# Altium project UC-523.PrjPCB (part 1 of 3)
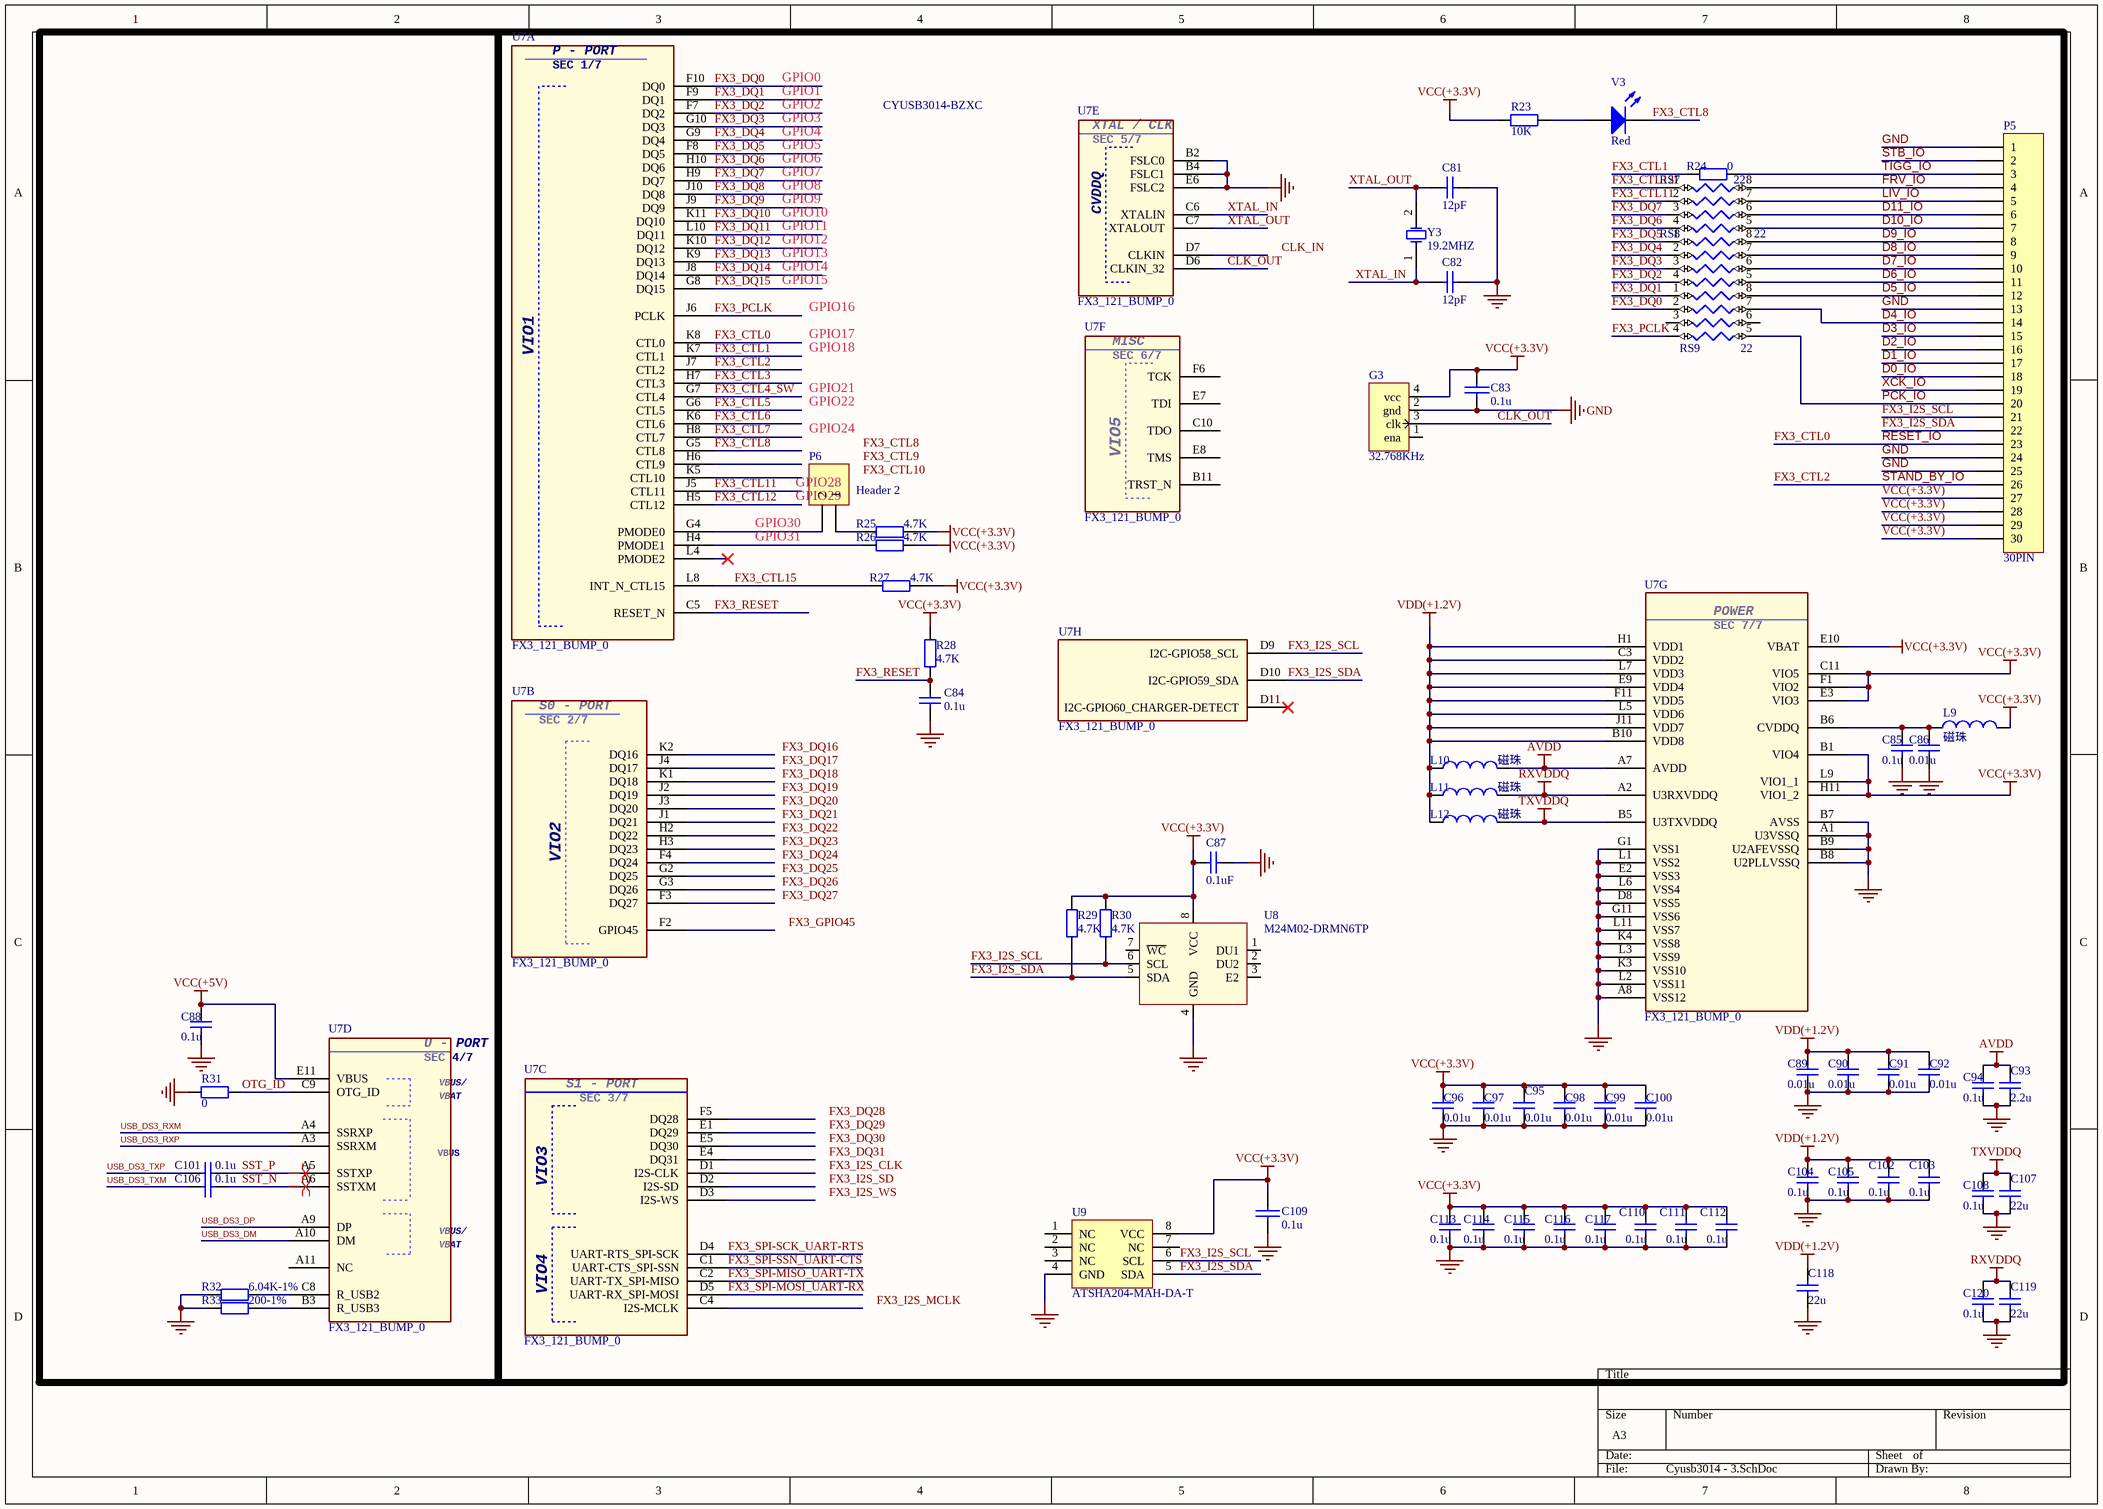
[diagram p0: Cyusb3014 - 3.SchDoc]
12 sheets, 764 parts. Net scope: flat (ports and power ports of the same name join across sheets).
Board file: UC-523.PcbDoc
Sheets:
  Cyusb3014 - 3.SchDoc
  Cyusb3014 - 4.SchDoc
  Cyusb3014 - 2.SchDoc
  LED_Driver - 2.SchDoc
  LED_Driver - 3.SchDoc
  LED_Driver - 4.SchDoc
  Cyusb3314_Power.SchDoc
  Cyusb3314_Interface.SchDoc
  Cyusb3314_Indicator.SchDoc
  Power.SchDoc
    U_Cyusb3014 - 1 = Cyusb3014 - 1.SchDoc
    U_LED_Driver - 1 = LED_Driver - 1.SchDoc

## Sheet Cyusb3014 - 3.SchDoc
size A3

### Parts
C81  12pF  [0603S-CAP]
C82  12pF  [0603S-CAP]
C83  0.1u  [0603S-CAP]
C84  0.1u  [0603S-CAP]
C85  0.1u  [C0402]
C86  0.01u  [C0402]
C87  0.1uF  [0603S-CAP]
C88  0.1u  [C0402]
C89  0.01u  [C0402]
C90  0.01u  [C0402]
C91  0.01u  [C0402]
C92  0.01u  [C0402]
C93  2.2u  [C0805S-CAP]
C94  0.1u  [C0402]
C95  0.01u  [C0402]
C96  0.01u  [C0402]
C97  0.01u  [C0402]
C98  0.01u  [C0402]
C99  0.01u  [C0402]
C100  0.01u  [C0402]
C101  0.1u  [C0402]
C102  0.1u  [C0402]
C103  0.1u  [C0402]
C104  0.1u  [C0402]
C105  0.1u  [C0402]
C106  0.1u  [C0402]
C107  22u  [C0805S-CAP]
C108  0.1u  [C0402]
C109  0.1u  [0603S-CAP]
C110  0.1u  [C0402]
C111  0.1u  [C0402]
C112  0.1u  [C0402]
C113  0.1u  [C0402]
C114  0.1u  [C0402]
C115  0.1u  [C0402]
C116  0.1u  [C0402]
C117  0.1u  [C0402]
C118  22u  [C0805S-CAP]
C119  22u  [C0805S-CAP]
C120  0.1u  [C0402]
G3  32.768KHz  [爱普生晶振3.2×2.5mm]
L9  磁珠  [L0603]
L10  磁珠  [L0603]
L11  磁珠  [L0603]
L12  磁珠  [L0603]
P5  30PIN  [FH12-30S-0.5SH]
P6  Header 2  [HDR1X2]
R23  10K  [0603S-RES]
R24  0  [0603S-RES]
R25  4.7K  [0603S-RES]
R26  4.7K  [0603S-RES]
R27  4.7K  [0603S-RES]
R28  4.7K  [0603S-RES]
R29  4.7K  [0603S-RES]
R30  4.7K  [0603S-RES]
R31  0  [0603S-RES]
R32  6.04K-1%  [0603S-RES]
R33  200-1%  [0603S-RES]
RS7  22  [NC06-4]
RS8  22  [NC06-4]
RS9  22  [NC06-4]
U7  FX3_121_BUMP_0  [121_BGA_FX3]  (parts A,B,C,D,E,F,G,H of 8)
U8  M24M02-DRMN6TP  [SOIC127P600X175-8N]
U9  ATSHA204-MAH-DA-T  [UDFN]
V3  Red  [LED0805S]
Y3  19.2MHZ  [爱普生晶振3.2×2.5MM - 无源]

### Nets
AVDD: C93.2 C94.1 L10.2 U7.A7(AVDD)
GND: C81.1 C82.1 C83.2 C84.1 C85.2 C86.2 C87.1 C88.2 C89.2 C90.2 C91.2 C92.2 C93.1 C94.2 C95.2 C96.2 C97.2 C98.2 C99.2 C100.2 C102.2 C103.2 C104.2 C105.2 C107.1 C108.2 C109.2 C110.2 C111.2 C112.2 C113.2 C114.2 C115.2 C116.2 C117.2 C118.1 C119.1 C120.2 G3.2(gnd) P5.1 P5.13 P5.24 P5.25 R31.2 R32.2 R33.2 U7.A1(U3VSSQ) U7.A8(VSS12) U7.B2(FSLC0) U7.B4(FSLC1) U7.B7(AVSS) U7.B8(U2PLLVSSQ) U7.B9(U2AFEVSSQ) U7.D8(VSS5) U7.E2(VSS3) U7.E6(FSLC2) U7.G1(VSS1) U7.G11(VSS6) U7.K3(VSS10) U7.K4(VSS8) U7.L1(VSS2) U7.L2(VSS11) U7.L3(VSS9) U7.L6(VSS4) U7.L11(VSS7) U8.4(GND) U9.4(GND)
RXVDDQ: C119.2 C120.1 L11.2 U7.A2(U3RXVDDQ)
TXVDDQ: C107.2 C108.1 L12.2 U7.B5(U3TXVDDQ)
VCC(+3.3V): C83.1 C87.2 C95.1 C96.1 C97.1 C98.1 C99.1 C100.1 C109.1 C110.1 C111.1 C112.1 C113.1 C114.1 C115.1 C116.1 C117.1 G3.4(vcc) L9.2 P5.27 P5.28 P5.29 P5.30 R23.2 R25.2 R26.2 R27.1 R28.1 R29.2 R30.2 U7.B1(VIO4) U7.C11(VIO5) U7.E3(VIO3) U7.E10(VBAT) U7.F1(VIO2) U7.H11(VIO1_2) U7.L9(VIO1_1) U8.8(VCC) U9.8(VCC)
VCC(+5V): C88.1 U7.E11(VBUS)
VDD(+1.2V): C89.1 C90.1 C91.1 C92.1 C102.1 C103.1 C104.1 C105.1 C118.2 L10.1 L11.1 L12.1 U7.B10(VDD8) U7.C3(VDD2) U7.E9(VDD4) U7.F11(VDD5) U7.H1(VDD1) U7.J11(VDD7) U7.L5(VDD6) U7.L7(VDD3)  [project net V1p2]
CLK_OUT: G3.3(clk) U7.D6(CLKIN_32)
D0_IO: P5.18
D1_IO: P5.17
D2_IO: P5.16
D3_IO: P5.15
D4_IO: P5.14 RS9.7
D5_IO: P5.12 RS9.8
D6_IO: P5.11 RS8.5
D7_IO: P5.10 RS8.6
D8_IO: P5.9 RS8.7
D9_IO: P5.8 RS8.8
D10_IO: P5.7 RS7.5
D11_IO: P5.6 RS7.6
FRV_IO: P5.4 RS7.8
FX3_CTL0: P5.23 U7.K8(CTL0)  [also labelled RESET_IO]
FX3_CTL1: R24.2 U7.K7(CTL1)
FX3_CTL2: P5.26 U7.J7(CTL2)  [also labelled STAND_BY_IO]
FX3_CTL3: U7.H7(CTL3)
FX3_CTL4_SW: U7.G7(CTL4)
FX3_CTL5: U7.G6(CTL5)
FX3_CTL6: U7.K6(CTL6)
FX3_CTL7: U7.H8(CTL7)
FX3_CTL8: U7.G5(CTL8) V3.2(K)
FX3_CTL11: RS7.2 U7.J5(CTL11)
FX3_CTL12: RS7.1 U7.H5(CTL12)
FX3_CTL15: R27.2 U7.L8(INT_N_CTL15)
FX3_DQ0: RS9.2 U7.F10(DQ0)
FX3_DQ1: RS9.1 U7.F9(DQ1)
FX3_DQ2: RS8.4 U7.F7(DQ2)
FX3_DQ3: RS8.3 U7.G10(DQ3)
FX3_DQ4: RS8.2 U7.G9(DQ4)
FX3_DQ5: RS8.1 U7.F8(DQ5)
FX3_DQ6: RS7.4 U7.H10(DQ6)
FX3_DQ7: RS7.3 U7.H9(DQ7)
FX3_DQ8: U7.J10(DQ8)
FX3_DQ9: U7.J9(DQ9)
FX3_DQ10: U7.K11(DQ10)
FX3_DQ11: U7.L10(DQ11)
FX3_DQ12: U7.K10(DQ12)
FX3_DQ13: U7.K9(DQ13)
FX3_DQ14: U7.J8(DQ14)
FX3_DQ15: U7.G8(DQ15)
FX3_I2S_SCL: P5.21 R30.1 U7.D9(I2C-GPIO58_SCL) U8.6(SCL) U9.6(SCL)
FX3_I2S_SDA: P5.22 R29.1 U7.D10(I2C-GPIO59_SDA) U8.5(SDA) U9.5(SDA)
FX3_PCLK: RS9.4 U7.J6(PCLK)
FX3_RESET: C84.2 R28.2 U7.C5(RESET_N)
FX3_SPI-MISO_UART-TX: U7.C2(UART-TX_SPI-MISO)
FX3_SPI-MOSI_UART-RX: U7.D5(UART-RX_SPI-MOSI)
FX3_SPI-SCK_UART-RTS: U7.D4(UART-RTS_SPI-SCK)
FX3_SPI-SSN_UART-CTS: U7.C1(UART-CTS_SPI-SSN)
LIV_IO: P5.5 RS7.7
OTG_ID: R31.1 U7.C9(OTG_ID)
PCK_IO: P5.20 RS9.5
SST_N: C106.2 U7.A6(SSTXM)
SST_P: C101.2 U7.A5(SSTXP)
STB_IO: P5.2
TIGG_IO: P5.3 R24.1
USB_DS3_DM: U7.A10(DM)
USB_DS3_DP: U7.A9(DP)
USB_DS3_RXM: U7.A4(SSRXP)
USB_DS3_RXP: U7.A3(SSRXM)
USB_DS3_TXM: C106.1
USB_DS3_TXP: C101.1
XCK_IO: P5.19
XTAL_IN: C82.2 U7.C6(XTALIN) Y3.1(OSC1)
XTAL_OUT: C81.2 U7.C7(XTALOUT) Y3.2(OSC2)
NetC85_1: C85.1 C86.1 L9.1 U7.B6(CVDDQ)
NetP6_1: P6.1 R25.1
NetP6_2: P6.2 U7.G4(PMODE0)
NetR23_1: R23.1 V3.1(A)
NetR26_1: R26.1 U7.H4(PMODE1)
NetR32_1: R32.1 U7.C8(R_USB2)
NetR33_1: R33.1 U7.B3(R_USB3)

Not connected (* = marked no-connect by the designer): G3 1(ena); RS9 3 6; U7 A11(NC) B11(TRST_N) C4(I2S-MCLK) C10(TDO) D1(I2S-CLK) D2(I2S-SD) D3(I2S-WS) D7(CLKIN) D11(I2C-GPIO60_CHARGER-DETECT)* E1(DQ29) E4(DQ31) E5(DQ30) E7(TDI) E8(TMS) F2(GPIO45) F3(DQ27) F4(DQ24) F5(DQ28) F6(TCK) G2(DQ25) G3(DQ26) H2(DQ22) H3(DQ23) H6(CTL9) J1(DQ21) J2(DQ19) J3(DQ20) J4(DQ17) K1(DQ18) K2(DQ16) K5(CTL10) L4(PMODE2)*; U8 1(DU1) 2(DU2) 3(E2) 7(~{WC}); U9 1(NC) 2(NC) 3(NC) 7(NC)

### Layout directives
differential pair: SST_N, SST_P

### Notes on the sheet
- GPIO0
- GPIO1
- GPIO2
- CYUSB3014-BZXC
- GPIO3
- GPIO4
- GPIO5
- GPIO6
- GPIO7
- GPIO8
- GPIO9
- GPIO10
- GPIO11
- GPIO12
- GPIO13
- GPIO14
- GPIO15
- GPIO16
- GPIO17
- GPIO18
- GPIO21
- GPIO22
- GPIO24
- (near P6) GPIO28
- (near P6) GPIO29
- (near P6) GPIO30
- (near P6) GPIO31
- Labels drawn without touching a wire or pin: CLK_IN, FX3_CTL8, FX3_CTL9, FX3_CTL10, FX3_DQ16, FX3_DQ17, FX3_DQ18, FX3_DQ19, FX3_DQ20, FX3_DQ21, FX3_DQ22, FX3_DQ23, FX3_DQ24, FX3_DQ25, FX3_DQ26, FX3_DQ27, FX3_DQ28, FX3_DQ29, FX3_DQ30, FX3_DQ31, FX3_GPIO45, FX3_I2S_CLK, FX3_I2S_MCLK, FX3_I2S_SD, FX3_I2S_WS
- (in symbol FX3_121_BUMP_0, part A) P - PORT; SEC 1/7; VIO1
- (in symbol FX3_121_BUMP_0, part B) S0 - PORT; SEC 2/7
- (in symbol FX3_121_BUMP_0, part C) S1 - PORT; SEC 3/7
- (in symbol FX3_121_BUMP_0, part D) U - PORT; SEC 4/7; VBUS/
- (in symbol FX3_121_BUMP_0, part E) XTAL / CLK; SEC 5/7
- (in symbol FX3_121_BUMP_0, part F) MISC; SEC 6/7
- (in symbol FX3_121_BUMP_0, part G) POWER; SEC 7/7

### Library data of the parts
C81 C82 = CAP CER SMT 4.3pF 0805: 2. Manufacturere Part Number: C0805C439D5GACTU; 1. Manufacturer: Kemet; 8. Alternate Part: any; 7. Package / Case: 0805; 0. Do Not Install: DNI; 6. Mounting Type: SMT; 5. Supplier Link: http://www.digikey.com/product-detail/en/C0805C439D5GACTU/C0805C439D5GACTU-ND/2212763; 3. Supplier: Digi-Key; 4. Supplier Part Number: C0805C439D5GACTU-ND
C83 C109 = CAP: RC=1206
C84 = Cap: 50V/8.2u/0805; Value: 100n; Published: 8-Jun-2000; LatestRevisionDate: 17-Jul-2002; LatestRevisionNote: Re-released for DXP Platform.; PackageReference: RAD-0.3; Publisher: Altium Limited
C85 C86 C88-C108 C110-C120 = CAP0805: Capacitor; Value: 104; Published: 8-Jun-2000; Revision: July-2002: Re-released for DXP Platform.; Publisher: Altium Limited
C87 = CAP SMT 0.1uF 16V X7R: 2. Manufacturere Part Number: C0805C104K4RACTU; 1. Manufacturer: Kemet; 8. Alternate Part: any; 7. Package / Case: 0805; 6. Mounting Type: SMT; 5. Supplier Link: http://www.digikey.com/product-detail/en/C0805C104K4RACTU/399-1167-1-ND/411442; 3. Supplier: Digi-Key; 4. Supplier Part Number: 399-1167-1-ND
G3 = CTY4-B
L9-L12 = Inductor: Code_IEC: 1005; Value: 10mH; Published: 8-Jun-2000; LatestRevisionDate: 29-May-2009; LatestRevisionNote: IPC-7351 Footprint Added.; PackageReference: 0402-A; Publisher: Altium Limited; PackageDescription: Chip Inductor; Code_JEITA: 0402
P5 = Header 30: Header, 30-Pin; LatestRevisionDate: 17-Jul-2002; LatestRevisionNote: Re-released for DXP Platform.; Publisher: Altium Limited
P6 = Header 2: Header, 2-Pin; LatestRevisionDate: 17-Jul-2002; LatestRevisionNote: Re-released for DXP Platform.; Publisher: Altium Limited
R23 = Res2: Resistor; Published: 8-Jun-2000; LatestRevisionDate: 17-Jul-2002; LatestRevisionNote: Re-released for DXP Platform.; PackageReference: AXIAL-0.4; Publisher: Altium Limited; Value: 10K
R24-R33 = Res2: Resistor; Value: 10K; Published: 8-Jun-2000; LatestRevisionDate: 17-Jul-2002; LatestRevisionNote: Re-released for DXP Platform.; PackageReference: AXIAL-0.4; Publisher: Altium Limited
RS7-RS9 = RN4: Option 2 - Device: *; Option 2 - Spec: *; Option 3 - Device: *; Option 3 - Spec: *; Option 4 - Device: *; Option 4 - Spec: *; Option 5 - Device: *; Option 5 - Spec: *; Option 6 - Device: *; Option 6 - Spec: *; Option 7 - Device: *; Option 7 - Spec: *; Option 8 - Device: *; Option 8 - Spec: *
U8 = 24LC64-I/SN: IC EEPROM 64KBIT 400KHZ 8SOIC; Manufacturer: Microchip Technology; Format - Memory: EEPROMs - Serial; Memory Size: 64K (8K x 8); Interface: I2C, 2-Wire Serial; Voltage - Supply: 2.5 V ~ 5.5 V; Supplier 1: Digi-Key; Manufacturer Part Number: 24LC64-I/SN; RoHS: RoHS Compliant; Category: Integrated Circuits (ICs); Stock 1: 16323; Pricing 1: 1=0.38, 25=0.37, 100=0.35 (USD); Packaging: Tube; Memory Type: EEPROM; Speed: 400kHz; Operating Temperature: -40°C ~ 85°C (TA); Package / Case: 8-SOIC (0.154", 3.90mm Width); Supplier Device Package: 8-SOIC; ComponentLink1URL: http://www.microchip.com/mymicrochip/filehandler.aspx?ddocname=en011843; ComponentLink1Description: http://www.microchip.com/mymicrochip/filehandler.aspx?ddocname=en011843; Supplier Part Number 1: 24LC64-I/SN-ND
U9 = AT24C128
V3 = LED0: Typical INFRARED GaAs LED; Published: 8-Jun-2000; LatestRevisionDate: 08-Jul-2005; LatestRevisionNote: Mech Layer 1 removed.; PackageReference: LED-0; Publisher: Altium Limited
Y3 = XTAL 32.768KHZ: Crystal, CRYSTAL 32.768KHZ 6PF SMD; 2. Manufacturere Part Number: ABS07-120-32.768KHZ-T; 1. Manufacturer: Abracon; 6. Mounting Type: SMT; 9. Notes: 2 pad - Abracon ABS07-120-32.768KHZ-T, 4 pad - Abracon ABS25-32.768KHZ-6-T; 0. Do Not Install: DNI; 5. Supplier Link: http://www.digikey.com/product-detail/en/ABS07-120-32.768KHZ-T/535-11937-1-ND/3724046; 3. Supplier: Digi-Key; 4. Supplier Part Number: 535-11937-1-ND

## Sheet Cyusb3014 - 4.SchDoc
size A3
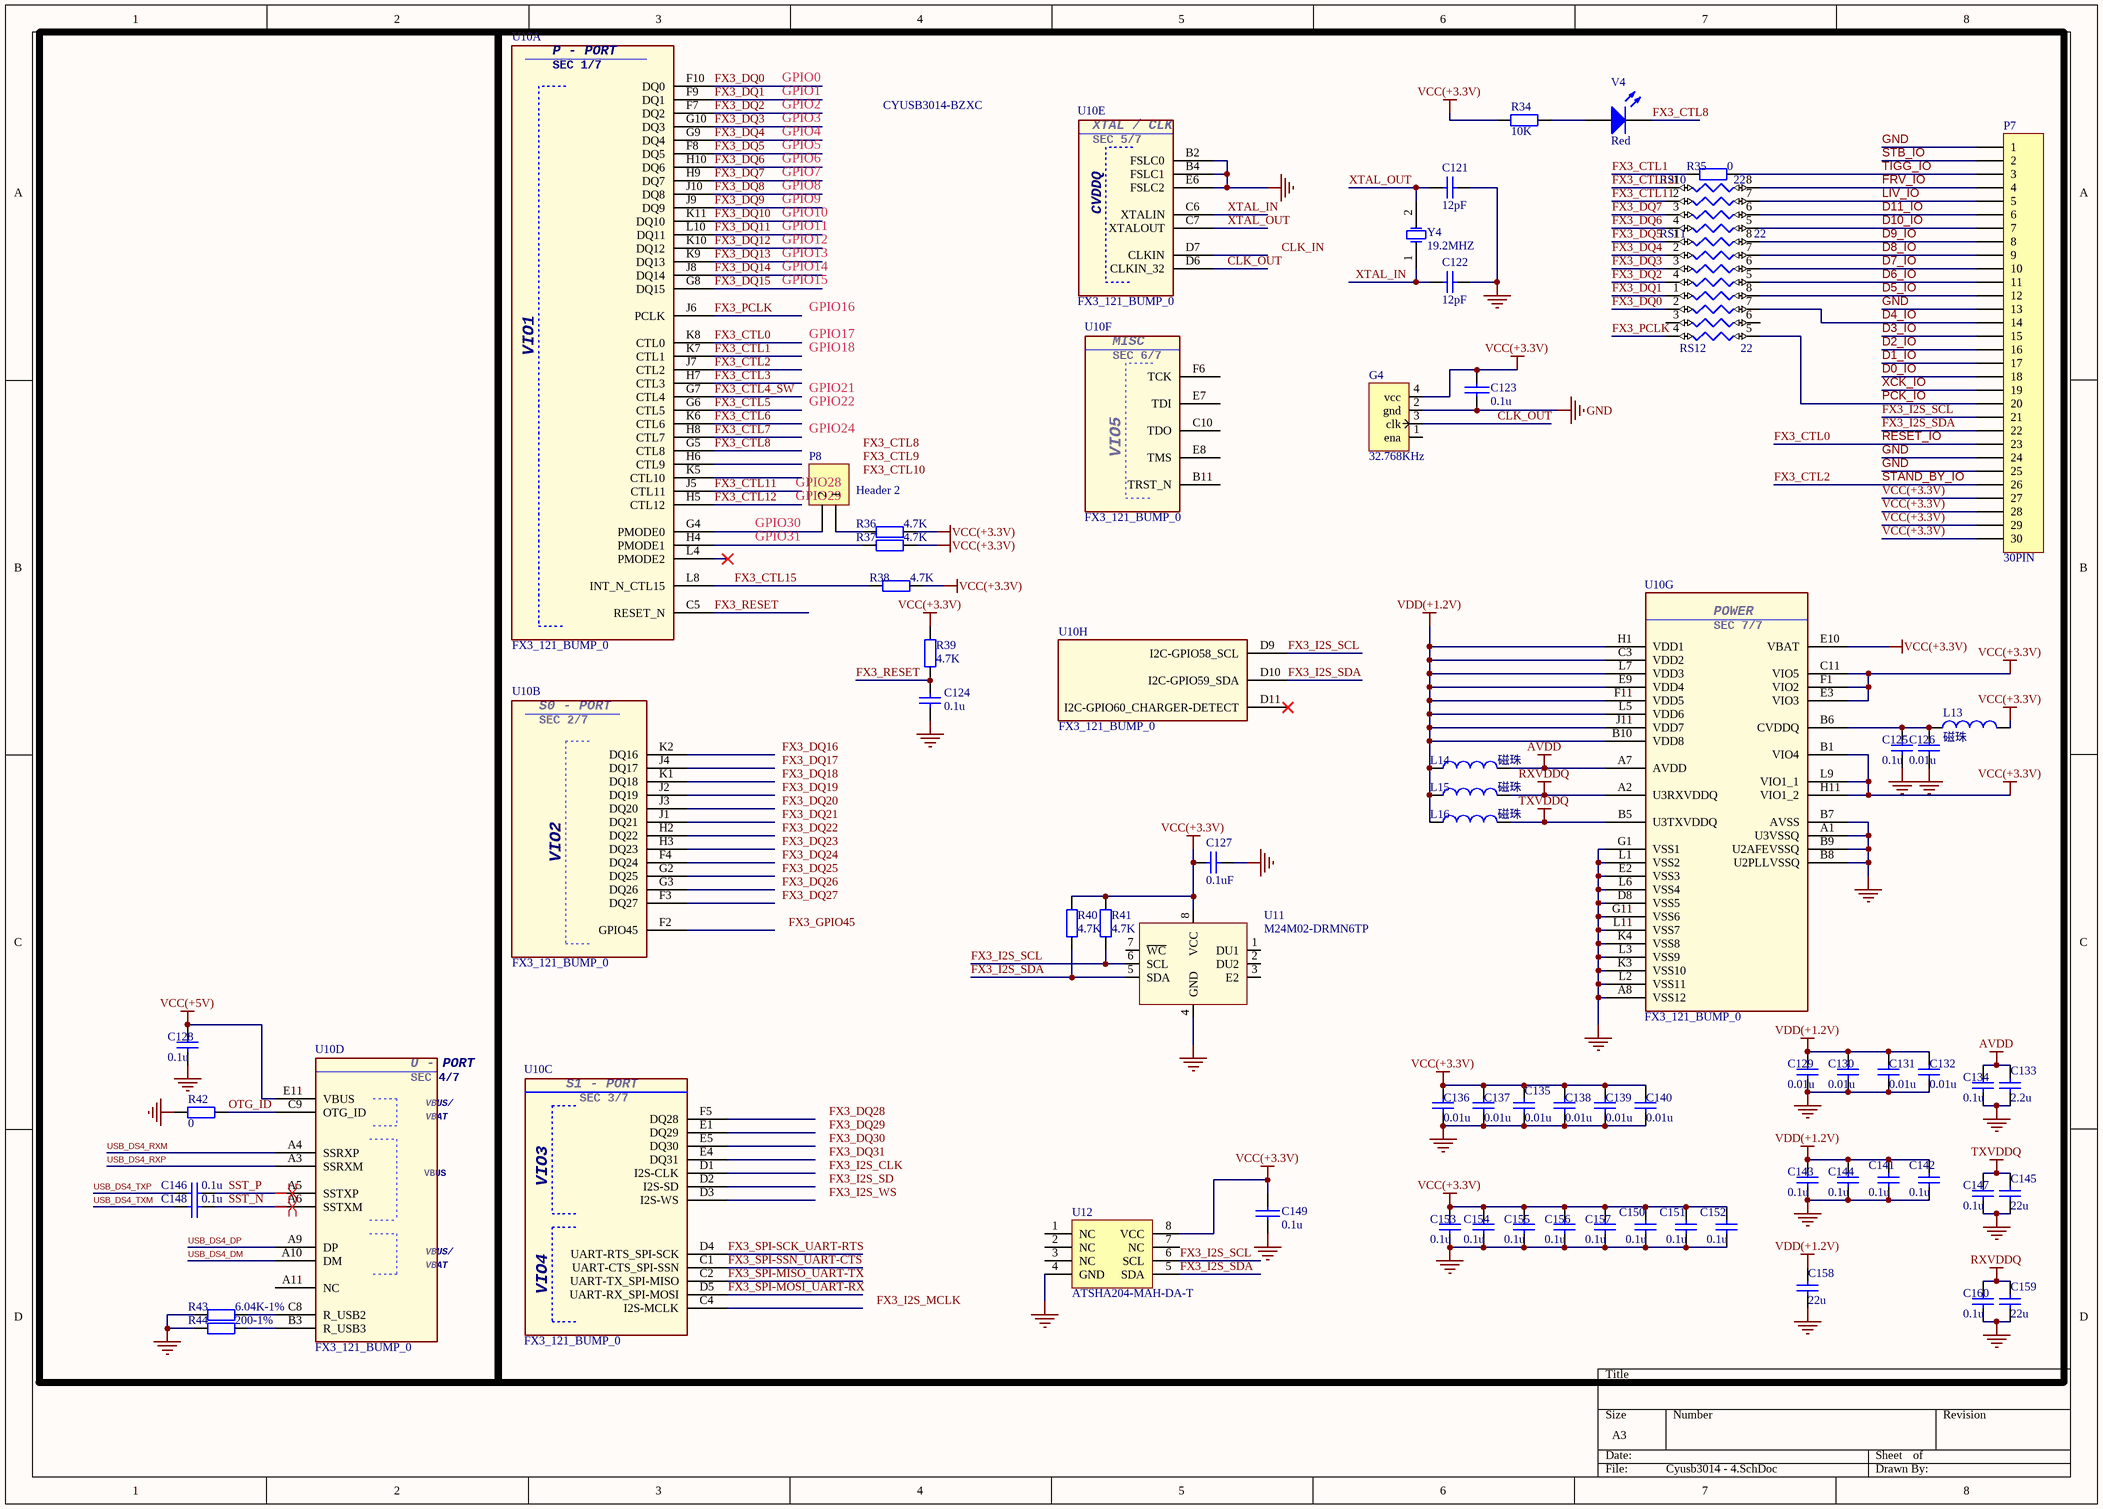
[diagram p1: Cyusb3014 - 4.SchDoc]

### Parts
C121  12pF  [0603S-CAP]
C122  12pF  [0603S-CAP]
C123  0.1u  [0603S-CAP]
C124  0.1u  [0603S-CAP]
C125  0.1u  [C0402]
C126  0.01u  [C0402]
C127  0.1uF  [0603S-CAP]
C128  0.1u  [C0402]
C129  0.01u  [C0402]
C130  0.01u  [C0402]
C131  0.01u  [C0402]
C132  0.01u  [C0402]
C133  2.2u  [C0805S-CAP]
C134  0.1u  [C0402]
C135  0.01u  [C0402]
C136  0.01u  [C0402]
C137  0.01u  [C0402]
C138  0.01u  [C0402]
C139  0.01u  [C0402]
C140  0.01u  [C0402]
C141  0.1u  [C0402]
C142  0.1u  [C0402]
C143  0.1u  [C0402]
C144  0.1u  [C0402]
C145  22u  [C0805S-CAP]
C146  0.1u  [C0402]
C147  0.1u  [C0402]
C148  0.1u  [C0402]
C149  0.1u  [0603S-CAP]
C150  0.1u  [C0402]
C151  0.1u  [C0402]
C152  0.1u  [C0402]
C153  0.1u  [C0402]
C154  0.1u  [C0402]
C155  0.1u  [C0402]
C156  0.1u  [C0402]
C157  0.1u  [C0402]
C158  22u  [C0805S-CAP]
C159  22u  [C0805S-CAP]
C160  0.1u  [C0402]
G4  32.768KHz  [爱普生晶振3.2×2.5mm]
L13  磁珠  [L0603]
L14  磁珠  [L0603]
L15  磁珠  [L0603]
L16  磁珠  [L0603]
P7  30PIN  [FH12-30S-0.5SH]
P8  Header 2  [HDR1X2]
R34  10K  [0603S-RES]
R35  0  [0603S-RES]
R36  4.7K  [0603S-RES]
R37  4.7K  [0603S-RES]
R38  4.7K  [0603S-RES]
R39  4.7K  [0603S-RES]
R40  4.7K  [0603S-RES]
R41  4.7K  [0603S-RES]
R42  0  [0603S-RES]
R43  6.04K-1%  [0603S-RES]
R44  200-1%  [0603S-RES]
RS10  22  [NC06-4]
RS11  22  [NC06-4]
RS12  22  [NC06-4]
U10  FX3_121_BUMP_0  [121_BGA_FX3]  (parts A,B,C,D,E,F,G,H of 8)
U11  M24M02-DRMN6TP  [SOIC127P600X175-8N]
U12  ATSHA204-MAH-DA-T  [UDFN]
V4  Red  [LED0805S]
Y4  19.2MHZ  [爱普生晶振3.2×2.5MM - 无源]

### Nets
AVDD: C133.2 C134.1 L14.2 U10.A7(AVDD)
GND: C121.1 C122.1 C123.2 C124.1 C125.2 C126.2 C127.1 C128.2 C129.2 C130.2 C131.2 C132.2 C133.1 C134.2 C135.2 C136.2 C137.2 C138.2 C139.2 C140.2 C141.2 C142.2 C143.2 C144.2 C145.1 C147.2 C149.2 C150.2 C151.2 C152.2 C153.2 C154.2 C155.2 C156.2 C157.2 C158.1 C159.1 C160.2 G4.2(gnd) P7.1 P7.13 P7.24 P7.25 R42.2 R43.2 R44.2 U10.A1(U3VSSQ) U10.A8(VSS12) U10.B2(FSLC0) U10.B4(FSLC1) U10.B7(AVSS) U10.B8(U2PLLVSSQ) U10.B9(U2AFEVSSQ) U10.D8(VSS5) U10.E2(VSS3) U10.E6(FSLC2) U10.G1(VSS1) U10.G11(VSS6) U10.K3(VSS10) U10.K4(VSS8) U10.L1(VSS2) U10.L2(VSS11) U10.L3(VSS9) U10.L6(VSS4) U10.L11(VSS7) U11.4(GND) U12.4(GND)
RXVDDQ: C159.2 C160.1 L15.2 U10.A2(U3RXVDDQ)
TXVDDQ: C145.2 C147.1 L16.2 U10.B5(U3TXVDDQ)
VCC(+3.3V): C123.1 C127.2 C135.1 C136.1 C137.1 C138.1 C139.1 C140.1 C149.1 C150.1 C151.1 C152.1 C153.1 C154.1 C155.1 C156.1 C157.1 G4.4(vcc) L13.2 P7.27 P7.28 P7.29 P7.30 R34.2 R36.2 R37.2 R38.1 R39.1 R40.2 R41.2 U10.B1(VIO4) U10.C11(VIO5) U10.E3(VIO3) U10.E10(VBAT) U10.F1(VIO2) U10.H11(VIO1_2) U10.L9(VIO1_1) U11.8(VCC) U12.8(VCC)
VCC(+5V): C128.1 U10.E11(VBUS)
VDD(+1.2V): C129.1 C130.1 C131.1 C132.1 C141.1 C142.1 C143.1 C144.1 C158.2 L14.1 L15.1 L16.1 U10.B10(VDD8) U10.C3(VDD2) U10.E9(VDD4) U10.F11(VDD5) U10.H1(VDD1) U10.J11(VDD7) U10.L5(VDD6) U10.L7(VDD3)  [project net V1p2]
CLK_OUT: G4.3(clk) U10.D6(CLKIN_32)
D0_IO: P7.18
D1_IO: P7.17
D2_IO: P7.16
D3_IO: P7.15
D4_IO: P7.14 RS12.7
D5_IO: P7.12 RS12.8
D6_IO: P7.11 RS11.5
D7_IO: P7.10 RS11.6
D8_IO: P7.9 RS11.7
D9_IO: P7.8 RS11.8
D10_IO: P7.7 RS10.5
D11_IO: P7.6 RS10.6
FRV_IO: P7.4 RS10.8
FX3_CTL0: P7.23 U10.K8(CTL0)  [also labelled RESET_IO]
FX3_CTL1: R35.2 U10.K7(CTL1)
FX3_CTL2: P7.26 U10.J7(CTL2)  [also labelled STAND_BY_IO]
FX3_CTL3: U10.H7(CTL3)
FX3_CTL4_SW: U10.G7(CTL4)
FX3_CTL5: U10.G6(CTL5)
FX3_CTL6: U10.K6(CTL6)
FX3_CTL7: U10.H8(CTL7)
FX3_CTL8: U10.G5(CTL8) V4.2(K)
FX3_CTL11: RS10.2 U10.J5(CTL11)
FX3_CTL12: RS10.1 U10.H5(CTL12)
FX3_CTL15: R38.2 U10.L8(INT_N_CTL15)
FX3_DQ0: RS12.2 U10.F10(DQ0)
FX3_DQ1: RS12.1 U10.F9(DQ1)
FX3_DQ2: RS11.4 U10.F7(DQ2)
FX3_DQ3: RS11.3 U10.G10(DQ3)
FX3_DQ4: RS11.2 U10.G9(DQ4)
FX3_DQ5: RS11.1 U10.F8(DQ5)
FX3_DQ6: RS10.4 U10.H10(DQ6)
FX3_DQ7: RS10.3 U10.H9(DQ7)
FX3_DQ8: U10.J10(DQ8)
FX3_DQ9: U10.J9(DQ9)
FX3_DQ10: U10.K11(DQ10)
FX3_DQ11: U10.L10(DQ11)
FX3_DQ12: U10.K10(DQ12)
FX3_DQ13: U10.K9(DQ13)
FX3_DQ14: U10.J8(DQ14)
FX3_DQ15: U10.G8(DQ15)
FX3_I2S_SCL: P7.21 R41.1 U10.D9(I2C-GPIO58_SCL) U11.6(SCL) U12.6(SCL)
FX3_I2S_SDA: P7.22 R40.1 U10.D10(I2C-GPIO59_SDA) U11.5(SDA) U12.5(SDA)
FX3_PCLK: RS12.4 U10.J6(PCLK)
FX3_RESET: C124.2 R39.2 U10.C5(RESET_N)
FX3_SPI-MISO_UART-TX: U10.C2(UART-TX_SPI-MISO)
FX3_SPI-MOSI_UART-RX: U10.D5(UART-RX_SPI-MOSI)
FX3_SPI-SCK_UART-RTS: U10.D4(UART-RTS_SPI-SCK)
FX3_SPI-SSN_UART-CTS: U10.C1(UART-CTS_SPI-SSN)
LIV_IO: P7.5 RS10.7
OTG_ID: R42.1 U10.C9(OTG_ID)
PCK_IO: P7.20 RS12.5
SST_N: C148.2 U10.A6(SSTXM)
SST_P: C146.2 U10.A5(SSTXP)
STB_IO: P7.2
TIGG_IO: P7.3 R35.1
USB_DS4_DM: U10.A10(DM)
USB_DS4_DP: U10.A9(DP)
USB_DS4_RXM: U10.A4(SSRXP)
USB_DS4_RXP: U10.A3(SSRXM)
USB_DS4_TXM: C148.1
USB_DS4_TXP: C146.1
XCK_IO: P7.19
XTAL_IN: C122.2 U10.C6(XTALIN) Y4.1(OSC1)
XTAL_OUT: C121.2 U10.C7(XTALOUT) Y4.2(OSC2)
NetC125_1: C125.1 C126.1 L13.1 U10.B6(CVDDQ)
NetP8_1: P8.1 R36.1
NetP8_2: P8.2 U10.G4(PMODE0)
NetR34_1: R34.1 V4.1(A)
NetR37_1: R37.1 U10.H4(PMODE1)
NetR43_1: R43.1 U10.C8(R_USB2)
NetR44_1: R44.1 U10.B3(R_USB3)

Not connected (* = marked no-connect by the designer): G4 1(ena); RS12 3 6; U10 A11(NC) B11(TRST_N) C4(I2S-MCLK) C10(TDO) D1(I2S-CLK) D2(I2S-SD) D3(I2S-WS) D7(CLKIN) D11(I2C-GPIO60_CHARGER-DETECT)* E1(DQ29) E4(DQ31) E5(DQ30) E7(TDI) E8(TMS) F2(GPIO45) F3(DQ27) F4(DQ24) F5(DQ28) F6(TCK) G2(DQ25) G3(DQ26) H2(DQ22) H3(DQ23) H6(CTL9) J1(DQ21) J2(DQ19) J3(DQ20) J4(DQ17) K1(DQ18) K2(DQ16) K5(CTL10) L4(PMODE2)*; U11 1(DU1) 2(DU2) 3(E2) 7(~{WC}); U12 1(NC) 2(NC) 3(NC) 7(NC)

### Layout directives
differential pair: SST_N, SST_P

### Notes on the sheet
- GPIO0
- GPIO1
- GPIO2
- CYUSB3014-BZXC
- GPIO3
- GPIO4
- GPIO5
- GPIO6
- GPIO7
- GPIO8
- GPIO9
- GPIO10
- GPIO11
- GPIO12
- GPIO13
- GPIO14
- GPIO15
- GPIO16
- GPIO17
- GPIO18
- GPIO21
- GPIO22
- GPIO24
- (near P8) GPIO28
- (near P8) GPIO29
- (near P8) GPIO30
- (near P8) GPIO31
- Labels drawn without touching a wire or pin: CLK_IN, FX3_CTL8, FX3_CTL9, FX3_CTL10, FX3_DQ16, FX3_DQ17, FX3_DQ18, FX3_DQ19, FX3_DQ20, FX3_DQ21, FX3_DQ22, FX3_DQ23, FX3_DQ24, FX3_DQ25, FX3_DQ26, FX3_DQ27, FX3_DQ28, FX3_DQ29, FX3_DQ30, FX3_DQ31, FX3_GPIO45, FX3_I2S_CLK, FX3_I2S_MCLK, FX3_I2S_SD, FX3_I2S_WS
- (in symbol FX3_121_BUMP_0, part A) P - PORT; SEC 1/7; VIO1
- (in symbol FX3_121_BUMP_0, part B) S0 - PORT; SEC 2/7
- (in symbol FX3_121_BUMP_0, part C) S1 - PORT; SEC 3/7
- (in symbol FX3_121_BUMP_0, part D) U - PORT; SEC 4/7; VBUS/
- (in symbol FX3_121_BUMP_0, part E) XTAL / CLK; SEC 5/7
- (in symbol FX3_121_BUMP_0, part F) MISC; SEC 6/7
- (in symbol FX3_121_BUMP_0, part G) POWER; SEC 7/7

### Library data of the parts
C121 C122 = CAP CER SMT 4.3pF 0805: as C81 on sheet Cyusb3014 - 3; 6. Mounting Type: SMT; 5. Supplier Link: http://www.digikey.com/product-detail/en/C0805C439D5GACTU/C0805C439D5GACTU-ND/2212763; 3. Supplier: Digi-Key; 4. Supplier Part Number: C0805C439D5GACTU-ND
C123 C149 = CAP: RC=1206
C124 = Cap: 50V/8.2u/0805; Value: 100n; Published: 8-Jun-2000; LatestRevisionDate: 17-Jul-2002; LatestRevisionNote: Re-released for DXP Platform.; PackageReference: RAD-0.3; Publisher: Altium Limited
C125 C126 C128-C148 C150-C160 = CAP0805: Capacitor; Value: 104; Published: 8-Jun-2000; Revision: July-2002: Re-released for DXP Platform.; Publisher: Altium Limited
C127 = CAP SMT 0.1uF 16V X7R: as C87 on sheet Cyusb3014 - 3; 6. Mounting Type: SMT; 5. Supplier Link: http://www.digikey.com/product-detail/en/C0805C104K4RACTU/399-1167-1-ND/411442; 3. Supplier: Digi-Key; 4. Supplier Part Number: 399-1167-1-ND
G4 = CTY4-B
L13-L16 = Inductor: Code_IEC: 1005; Value: 10mH; Published: 8-Jun-2000; LatestRevisionDate: 29-May-2009; LatestRevisionNote: IPC-7351 Footprint Added.; PackageReference: 0402-A; Publisher: Altium Limited; PackageDescription: Chip Inductor; Code_JEITA: 0402
P7 = Header 30: Header, 30-Pin; LatestRevisionDate: 17-Jul-2002; LatestRevisionNote: Re-released for DXP Platform.; Publisher: Altium Limited
P8 = Header 2: Header, 2-Pin; LatestRevisionDate: 17-Jul-2002; LatestRevisionNote: Re-released for DXP Platform.; Publisher: Altium Limited
R34 = Res2: Resistor; Published: 8-Jun-2000; LatestRevisionDate: 17-Jul-2002; LatestRevisionNote: Re-released for DXP Platform.; PackageReference: AXIAL-0.4; Publisher: Altium Limited; Value: 10K
R35-R44 = Res2: Resistor; Value: 10K; Published: 8-Jun-2000; LatestRevisionDate: 17-Jul-2002; LatestRevisionNote: Re-released for DXP Platform.; PackageReference: AXIAL-0.4; Publisher: Altium Limited
RS10-RS12 = RN4: Option 2 - Device: *; Option 2 - Spec: *; Option 3 - Device: *; Option 3 - Spec: *; Option 4 - Device: *; Option 4 - Spec: *; Option 5 - Device: *; Option 5 - Spec: *; Option 6 - Device: *; Option 6 - Spec: *; Option 7 - Device: *; Option 7 - Spec: *; Option 8 - Device: *; Option 8 - Spec: *
U11 = 24LC64-I/SN: as U8 on sheet Cyusb3014 - 3; Supplier 1: Digi-Key; Manufacturer Part Number: 24LC64-I/SN; RoHS: RoHS Compliant; Category: Integrated Circuits (ICs); Stock 1: 16323; Pricing 1: 1=0.38, 25=0.37, 100=0.35 (USD); Packaging: Tube; Memory Type: EEPROM; Speed: 400kHz; Operating Temperature: -40°C ~ 85°C (TA); Package / Case: 8-SOIC (0.154", 3.90mm Width); Supplier Device Package: 8-SOIC; ComponentLink1URL: http://www.microchip.com/mymicrochip/filehandler.aspx?ddocname=en011843; ComponentLink1Description: http://www.microchip.com/mymicrochip/filehandler.aspx?ddocname=en011843; Supplier Part Number 1: 24LC64-I/SN-ND
U12 = AT24C128
V4 = LED0: Typical INFRARED GaAs LED; Published: 8-Jun-2000; LatestRevisionDate: 08-Jul-2005; LatestRevisionNote: Mech Layer 1 removed.; PackageReference: LED-0; Publisher: Altium Limited
Y4 = XTAL 32.768KHZ: as Y3 on sheet Cyusb3014 - 3; 5. Supplier Link: http://www.digikey.com/product-detail/en/ABS07-120-32.768KHZ-T/535-11937-1-ND/3724046; 3. Supplier: Digi-Key; 4. Supplier Part Number: 535-11937-1-ND

## Sheet Cyusb3014 - 2.SchDoc
size A3
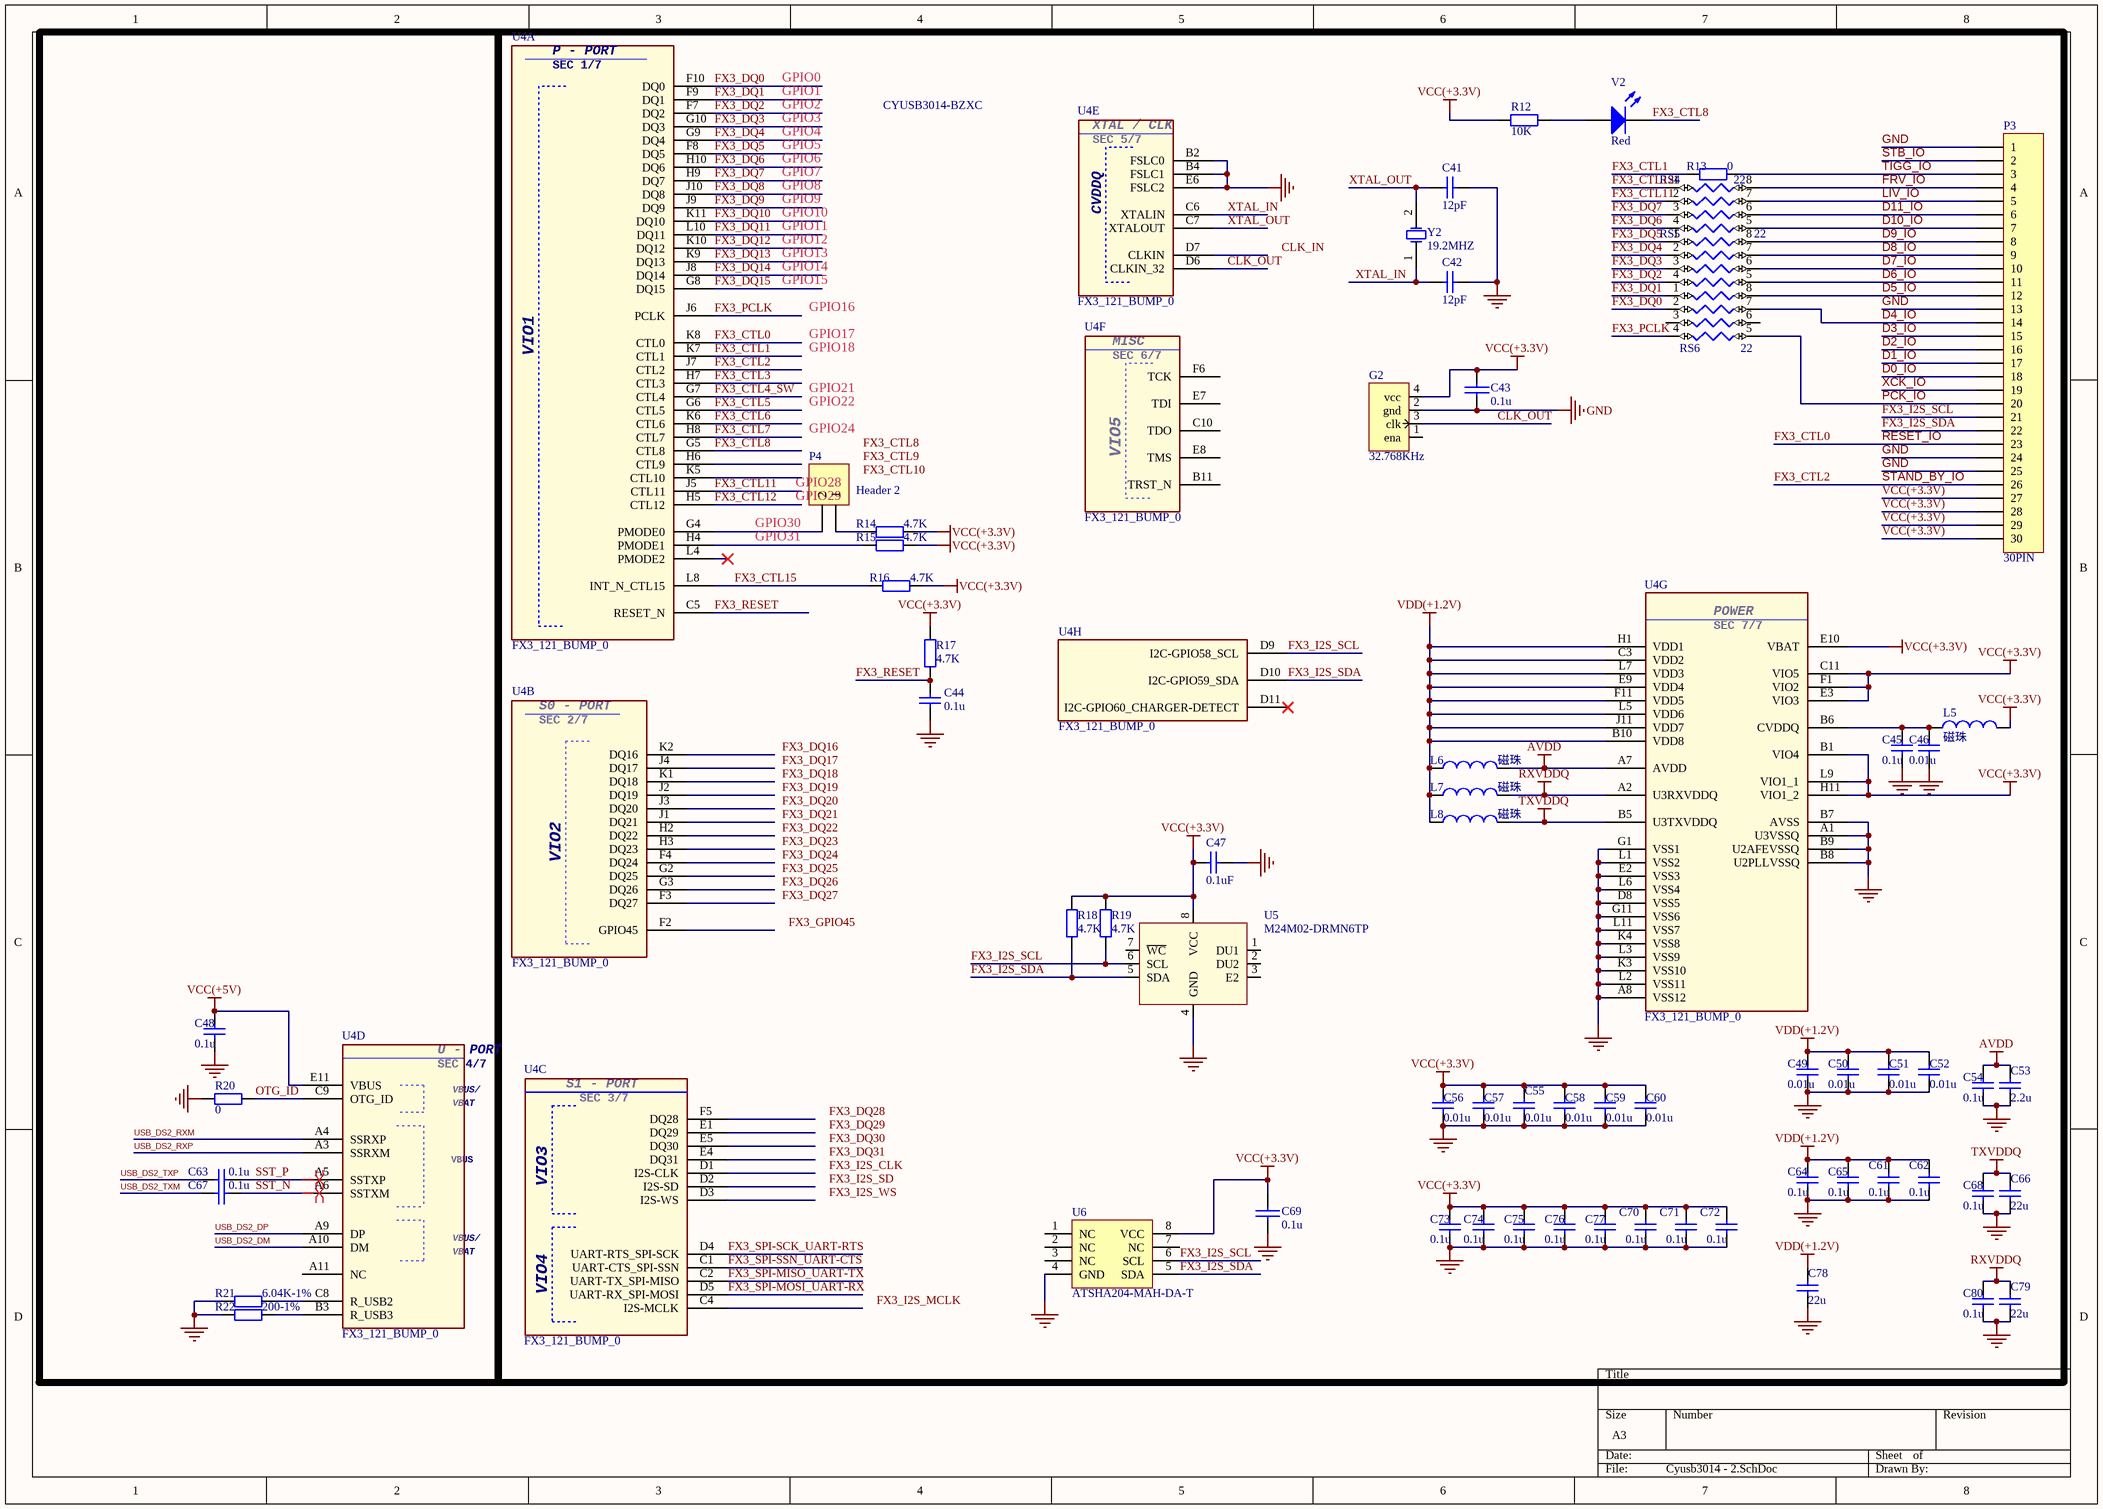
[diagram p2: Cyusb3014 - 2.SchDoc]

### Parts
C41  12pF  [0603S-CAP]
C42  12pF  [0603S-CAP]
C43  0.1u  [0603S-CAP]
C44  0.1u  [0603S-CAP]
C45  0.1u  [C0402]
C46  0.01u  [C0402]
C47  0.1uF  [0603S-CAP]
C48  0.1u  [C0402]
C49  0.01u  [C0402]
C50  0.01u  [C0402]
C51  0.01u  [C0402]
C52  0.01u  [C0402]
C53  2.2u  [C0805S-CAP]
C54  0.1u  [C0402]
C55  0.01u  [C0402]
C56  0.01u  [C0402]
C57  0.01u  [C0402]
C58  0.01u  [C0402]
C59  0.01u  [C0402]
C60  0.01u  [C0402]
C61  0.1u  [C0402]
C62  0.1u  [C0402]
C63  0.1u  [C0402]
C64  0.1u  [C0402]
C65  0.1u  [C0402]
C66  22u  [C0805S-CAP]
C67  0.1u  [C0402]
C68  0.1u  [C0402]
C69  0.1u  [0603S-CAP]
C70  0.1u  [C0402]
C71  0.1u  [C0402]
C72  0.1u  [C0402]
C73  0.1u  [C0402]
C74  0.1u  [C0402]
C75  0.1u  [C0402]
C76  0.1u  [C0402]
C77  0.1u  [C0402]
C78  22u  [C0805S-CAP]
C79  22u  [C0805S-CAP]
C80  0.1u  [C0402]
G2  32.768KHz  [爱普生晶振3.2×2.5mm]
L5  磁珠  [L0603]
L6  磁珠  [L0603]
L7  磁珠  [L0603]
L8  磁珠  [L0603]
P3  30PIN  [FH12-30S-0.5SH]
P4  Header 2  [HDR1X2]
R12  10K  [0603S-RES]
R13  0  [0603S-RES]
R14  4.7K  [0603S-RES]
R15  4.7K  [0603S-RES]
R16  4.7K  [0603S-RES]
R17  4.7K  [0603S-RES]
R18  4.7K  [0603S-RES]
R19  4.7K  [0603S-RES]
R20  0  [0603S-RES]
R21  6.04K-1%  [0603S-RES]
R22  200-1%  [0603S-RES]
RS4  22  [NC06-4]
RS5  22  [NC06-4]
RS6  22  [NC06-4]
U4  FX3_121_BUMP_0  [121_BGA_FX3]  (parts A,B,C,D,E,F,G,H of 8)
U5  M24M02-DRMN6TP  [SOIC127P600X175-8N]
U6  ATSHA204-MAH-DA-T  [UDFN]
V2  Red  [LED0805S]
Y2  19.2MHZ  [爱普生晶振3.2×2.5MM - 无源]

### Nets
AVDD: C53.2 C54.1 L6.2 U4.A7(AVDD)
GND: C41.1 C42.1 C43.2 C44.1 C45.2 C46.2 C47.1 C48.2 C49.2 C50.2 C51.2 C52.2 C53.1 C54.2 C55.2 C56.2 C57.2 C58.2 C59.2 C60.2 C61.2 C62.2 C64.2 C65.2 C66.1 C68.2 C69.2 C70.2 C71.2 C72.2 C73.2 C74.2 C75.2 C76.2 C77.2 C78.1 C79.1 C80.2 G2.2(gnd) P3.1 P3.13 P3.24 P3.25 R20.2 R21.2 R22.2 U4.A1(U3VSSQ) U4.A8(VSS12) U4.B2(FSLC0) U4.B4(FSLC1) U4.B7(AVSS) U4.B8(U2PLLVSSQ) U4.B9(U2AFEVSSQ) U4.D8(VSS5) U4.E2(VSS3) U4.E6(FSLC2) U4.G1(VSS1) U4.G11(VSS6) U4.K3(VSS10) U4.K4(VSS8) U4.L1(VSS2) U4.L2(VSS11) U4.L3(VSS9) U4.L6(VSS4) U4.L11(VSS7) U5.4(GND) U6.4(GND)
RXVDDQ: C79.2 C80.1 L7.2 U4.A2(U3RXVDDQ)
TXVDDQ: C66.2 C68.1 L8.2 U4.B5(U3TXVDDQ)
VCC(+3.3V): C43.1 C47.2 C55.1 C56.1 C57.1 C58.1 C59.1 C60.1 C69.1 C70.1 C71.1 C72.1 C73.1 C74.1 C75.1 C76.1 C77.1 G2.4(vcc) L5.2 P3.27 P3.28 P3.29 P3.30 R12.2 R14.2 R15.2 R16.1 R17.1 R18.2 R19.2 U4.B1(VIO4) U4.C11(VIO5) U4.E3(VIO3) U4.E10(VBAT) U4.F1(VIO2) U4.H11(VIO1_2) U4.L9(VIO1_1) U5.8(VCC) U6.8(VCC)
VCC(+5V): C48.1 U4.E11(VBUS)
VDD(+1.2V): C49.1 C50.1 C51.1 C52.1 C61.1 C62.1 C64.1 C65.1 C78.2 L6.1 L7.1 L8.1 U4.B10(VDD8) U4.C3(VDD2) U4.E9(VDD4) U4.F11(VDD5) U4.H1(VDD1) U4.J11(VDD7) U4.L5(VDD6) U4.L7(VDD3)  [project net V1p2]
CLK_OUT: G2.3(clk) U4.D6(CLKIN_32)
D0_IO: P3.18
D1_IO: P3.17
D2_IO: P3.16
D3_IO: P3.15
D4_IO: P3.14 RS6.7
D5_IO: P3.12 RS6.8
D6_IO: P3.11 RS5.5
D7_IO: P3.10 RS5.6
D8_IO: P3.9 RS5.7
D9_IO: P3.8 RS5.8
D10_IO: P3.7 RS4.5
D11_IO: P3.6 RS4.6
FRV_IO: P3.4 RS4.8
FX3_CTL0: P3.23 U4.K8(CTL0)  [also labelled RESET_IO]
FX3_CTL1: R13.2 U4.K7(CTL1)
FX3_CTL2: P3.26 U4.J7(CTL2)  [also labelled STAND_BY_IO]
FX3_CTL3: U4.H7(CTL3)
FX3_CTL4_SW: U4.G7(CTL4)
FX3_CTL5: U4.G6(CTL5)
FX3_CTL6: U4.K6(CTL6)
FX3_CTL7: U4.H8(CTL7)
FX3_CTL8: U4.G5(CTL8) V2.2(K)
FX3_CTL11: RS4.2 U4.J5(CTL11)
FX3_CTL12: RS4.1 U4.H5(CTL12)
FX3_CTL15: R16.2 U4.L8(INT_N_CTL15)
FX3_DQ0: RS6.2 U4.F10(DQ0)
FX3_DQ1: RS6.1 U4.F9(DQ1)
FX3_DQ2: RS5.4 U4.F7(DQ2)
FX3_DQ3: RS5.3 U4.G10(DQ3)
FX3_DQ4: RS5.2 U4.G9(DQ4)
FX3_DQ5: RS5.1 U4.F8(DQ5)
FX3_DQ6: RS4.4 U4.H10(DQ6)
FX3_DQ7: RS4.3 U4.H9(DQ7)
FX3_DQ8: U4.J10(DQ8)
FX3_DQ9: U4.J9(DQ9)
FX3_DQ10: U4.K11(DQ10)
FX3_DQ11: U4.L10(DQ11)
FX3_DQ12: U4.K10(DQ12)
FX3_DQ13: U4.K9(DQ13)
FX3_DQ14: U4.J8(DQ14)
FX3_DQ15: U4.G8(DQ15)
FX3_I2S_SCL: P3.21 R19.1 U4.D9(I2C-GPIO58_SCL) U5.6(SCL) U6.6(SCL)
FX3_I2S_SDA: P3.22 R18.1 U4.D10(I2C-GPIO59_SDA) U5.5(SDA) U6.5(SDA)
FX3_PCLK: RS6.4 U4.J6(PCLK)
FX3_RESET: C44.2 R17.2 U4.C5(RESET_N)
FX3_SPI-MISO_UART-TX: U4.C2(UART-TX_SPI-MISO)
FX3_SPI-MOSI_UART-RX: U4.D5(UART-RX_SPI-MOSI)
FX3_SPI-SCK_UART-RTS: U4.D4(UART-RTS_SPI-SCK)
FX3_SPI-SSN_UART-CTS: U4.C1(UART-CTS_SPI-SSN)
LIV_IO: P3.5 RS4.7
OTG_ID: R20.1 U4.C9(OTG_ID)
PCK_IO: P3.20 RS6.5
SST_N: C67.2 U4.A6(SSTXM)
SST_P: C63.2 U4.A5(SSTXP)
STB_IO: P3.2
TIGG_IO: P3.3 R13.1
USB_DS2_DM: U4.A10(DM)
USB_DS2_DP: U4.A9(DP)
USB_DS2_RXM: U4.A4(SSRXP)
USB_DS2_RXP: U4.A3(SSRXM)
USB_DS2_TXM: C67.1
USB_DS2_TXP: C63.1
XCK_IO: P3.19
XTAL_IN: C42.2 U4.C6(XTALIN) Y2.1(OSC1)
XTAL_OUT: C41.2 U4.C7(XTALOUT) Y2.2(OSC2)
NetC45_1: C45.1 C46.1 L5.1 U4.B6(CVDDQ)
NetP4_1: P4.1 R14.1
NetP4_2: P4.2 U4.G4(PMODE0)
NetR12_1: R12.1 V2.1(A)
NetR15_1: R15.1 U4.H4(PMODE1)
NetR21_1: R21.1 U4.C8(R_USB2)
NetR22_1: R22.1 U4.B3(R_USB3)

Not connected (* = marked no-connect by the designer): G2 1(ena); RS6 3 6; U4 A11(NC) B11(TRST_N) C4(I2S-MCLK) C10(TDO) D1(I2S-CLK) D2(I2S-SD) D3(I2S-WS) D7(CLKIN) D11(I2C-GPIO60_CHARGER-DETECT)* E1(DQ29) E4(DQ31) E5(DQ30) E7(TDI) E8(TMS) F2(GPIO45) F3(DQ27) F4(DQ24) F5(DQ28) F6(TCK) G2(DQ25) G3(DQ26) H2(DQ22) H3(DQ23) H6(CTL9) J1(DQ21) J2(DQ19) J3(DQ20) J4(DQ17) K1(DQ18) K2(DQ16) K5(CTL10) L4(PMODE2)*; U5 1(DU1) 2(DU2) 3(E2) 7(~{WC}); U6 1(NC) 2(NC) 3(NC) 7(NC)

### Layout directives
differential pair: SST_N, SST_P

### Notes on the sheet
- GPIO0
- GPIO1
- GPIO2
- CYUSB3014-BZXC
- GPIO3
- GPIO4
- GPIO5
- GPIO6
- GPIO7
- GPIO8
- GPIO9
- GPIO10
- GPIO11
- GPIO12
- GPIO13
- GPIO14
- GPIO15
- GPIO16
- GPIO17
- GPIO18
- GPIO21
- GPIO22
- GPIO24
- (near P4) GPIO28
- (near P4) GPIO29
- (near P4) GPIO30
- (near P4) GPIO31
- Labels drawn without touching a wire or pin: CLK_IN, FX3_CTL8, FX3_CTL9, FX3_CTL10, FX3_DQ16, FX3_DQ17, FX3_DQ18, FX3_DQ19, FX3_DQ20, FX3_DQ21, FX3_DQ22, FX3_DQ23, FX3_DQ24, FX3_DQ25, FX3_DQ26, FX3_DQ27, FX3_DQ28, FX3_DQ29, FX3_DQ30, FX3_DQ31, FX3_GPIO45, FX3_I2S_CLK, FX3_I2S_MCLK, FX3_I2S_SD, FX3_I2S_WS
- (in symbol FX3_121_BUMP_0, part A) P - PORT; SEC 1/7; VIO1
- (in symbol FX3_121_BUMP_0, part B) S0 - PORT; SEC 2/7
- (in symbol FX3_121_BUMP_0, part C) S1 - PORT; SEC 3/7
- (in symbol FX3_121_BUMP_0, part D) U - PORT; SEC 4/7; VBUS/
- (in symbol FX3_121_BUMP_0, part E) XTAL / CLK; SEC 5/7
- (in symbol FX3_121_BUMP_0, part F) MISC; SEC 6/7
- (in symbol FX3_121_BUMP_0, part G) POWER; SEC 7/7

### Library data of the parts
C41 C42 = CAP CER SMT 4.3pF 0805: as C81 on sheet Cyusb3014 - 3; 6. Mounting Type: SMT; 5. Supplier Link: http://www.digikey.com/product-detail/en/C0805C439D5GACTU/C0805C439D5GACTU-ND/2212763; 3. Supplier: Digi-Key; 4. Supplier Part Number: C0805C439D5GACTU-ND
C43 C69 = CAP: RC=1206
C44 = Cap: 50V/8.2u/0805; Value: 100n; Published: 8-Jun-2000; LatestRevisionDate: 17-Jul-2002; LatestRevisionNote: Re-released for DXP Platform.; PackageReference: RAD-0.3; Publisher: Altium Limited
C45 C46 C48-C68 C70-C80 = CAP0805: Capacitor; Value: 104; Published: 8-Jun-2000; Revision: July-2002: Re-released for DXP Platform.; Publisher: Altium Limited
C47 = CAP SMT 0.1uF 16V X7R: as C87 on sheet Cyusb3014 - 3; 6. Mounting Type: SMT; 5. Supplier Link: http://www.digikey.com/product-detail/en/C0805C104K4RACTU/399-1167-1-ND/411442; 3. Supplier: Digi-Key; 4. Supplier Part Number: 399-1167-1-ND
G2 = CTY4-B
L5-L8 = Inductor: Code_IEC: 1005; Value: 10mH; Published: 8-Jun-2000; LatestRevisionDate: 29-May-2009; LatestRevisionNote: IPC-7351 Footprint Added.; PackageReference: 0402-A; Publisher: Altium Limited; PackageDescription: Chip Inductor; Code_JEITA: 0402
P3 = Header 30: Header, 30-Pin; LatestRevisionDate: 17-Jul-2002; LatestRevisionNote: Re-released for DXP Platform.; Publisher: Altium Limited
P4 = Header 2: Header, 2-Pin; LatestRevisionDate: 17-Jul-2002; LatestRevisionNote: Re-released for DXP Platform.; Publisher: Altium Limited
R12 = Res2: Resistor; Published: 8-Jun-2000; LatestRevisionDate: 17-Jul-2002; LatestRevisionNote: Re-released for DXP Platform.; PackageReference: AXIAL-0.4; Publisher: Altium Limited; Value: 10K
R13-R22 = Res2: Resistor; Value: 10K; Published: 8-Jun-2000; LatestRevisionDate: 17-Jul-2002; LatestRevisionNote: Re-released for DXP Platform.; PackageReference: AXIAL-0.4; Publisher: Altium Limited
RS4-RS6 = RN4: Option 2 - Device: *; Option 2 - Spec: *; Option 3 - Device: *; Option 3 - Spec: *; Option 4 - Device: *; Option 4 - Spec: *; Option 5 - Device: *; Option 5 - Spec: *; Option 6 - Device: *; Option 6 - Spec: *; Option 7 - Device: *; Option 7 - Spec: *; Option 8 - Device: *; Option 8 - Spec: *
U5 = 24LC64-I/SN: as U8 on sheet Cyusb3014 - 3; Supplier 1: Digi-Key; Manufacturer Part Number: 24LC64-I/SN; RoHS: RoHS Compliant; Category: Integrated Circuits (ICs); Stock 1: 16323; Pricing 1: 1=0.38, 25=0.37, 100=0.35 (USD); Packaging: Tube; Memory Type: EEPROM; Speed: 400kHz; Operating Temperature: -40°C ~ 85°C (TA); Package / Case: 8-SOIC (0.154", 3.90mm Width); Supplier Device Package: 8-SOIC; ComponentLink1URL: http://www.microchip.com/mymicrochip/filehandler.aspx?ddocname=en011843; ComponentLink1Description: http://www.microchip.com/mymicrochip/filehandler.aspx?ddocname=en011843; Supplier Part Number 1: 24LC64-I/SN-ND
U6 = AT24C128
V2 = LED0: Typical INFRARED GaAs LED; Published: 8-Jun-2000; LatestRevisionDate: 08-Jul-2005; LatestRevisionNote: Mech Layer 1 removed.; PackageReference: LED-0; Publisher: Altium Limited
Y2 = XTAL 32.768KHZ: as Y3 on sheet Cyusb3014 - 3; 5. Supplier Link: http://www.digikey.com/product-detail/en/ABS07-120-32.768KHZ-T/535-11937-1-ND/3724046; 3. Supplier: Digi-Key; 4. Supplier Part Number: 535-11937-1-ND

## Sheet LED_Driver - 2.SchDoc
size A3
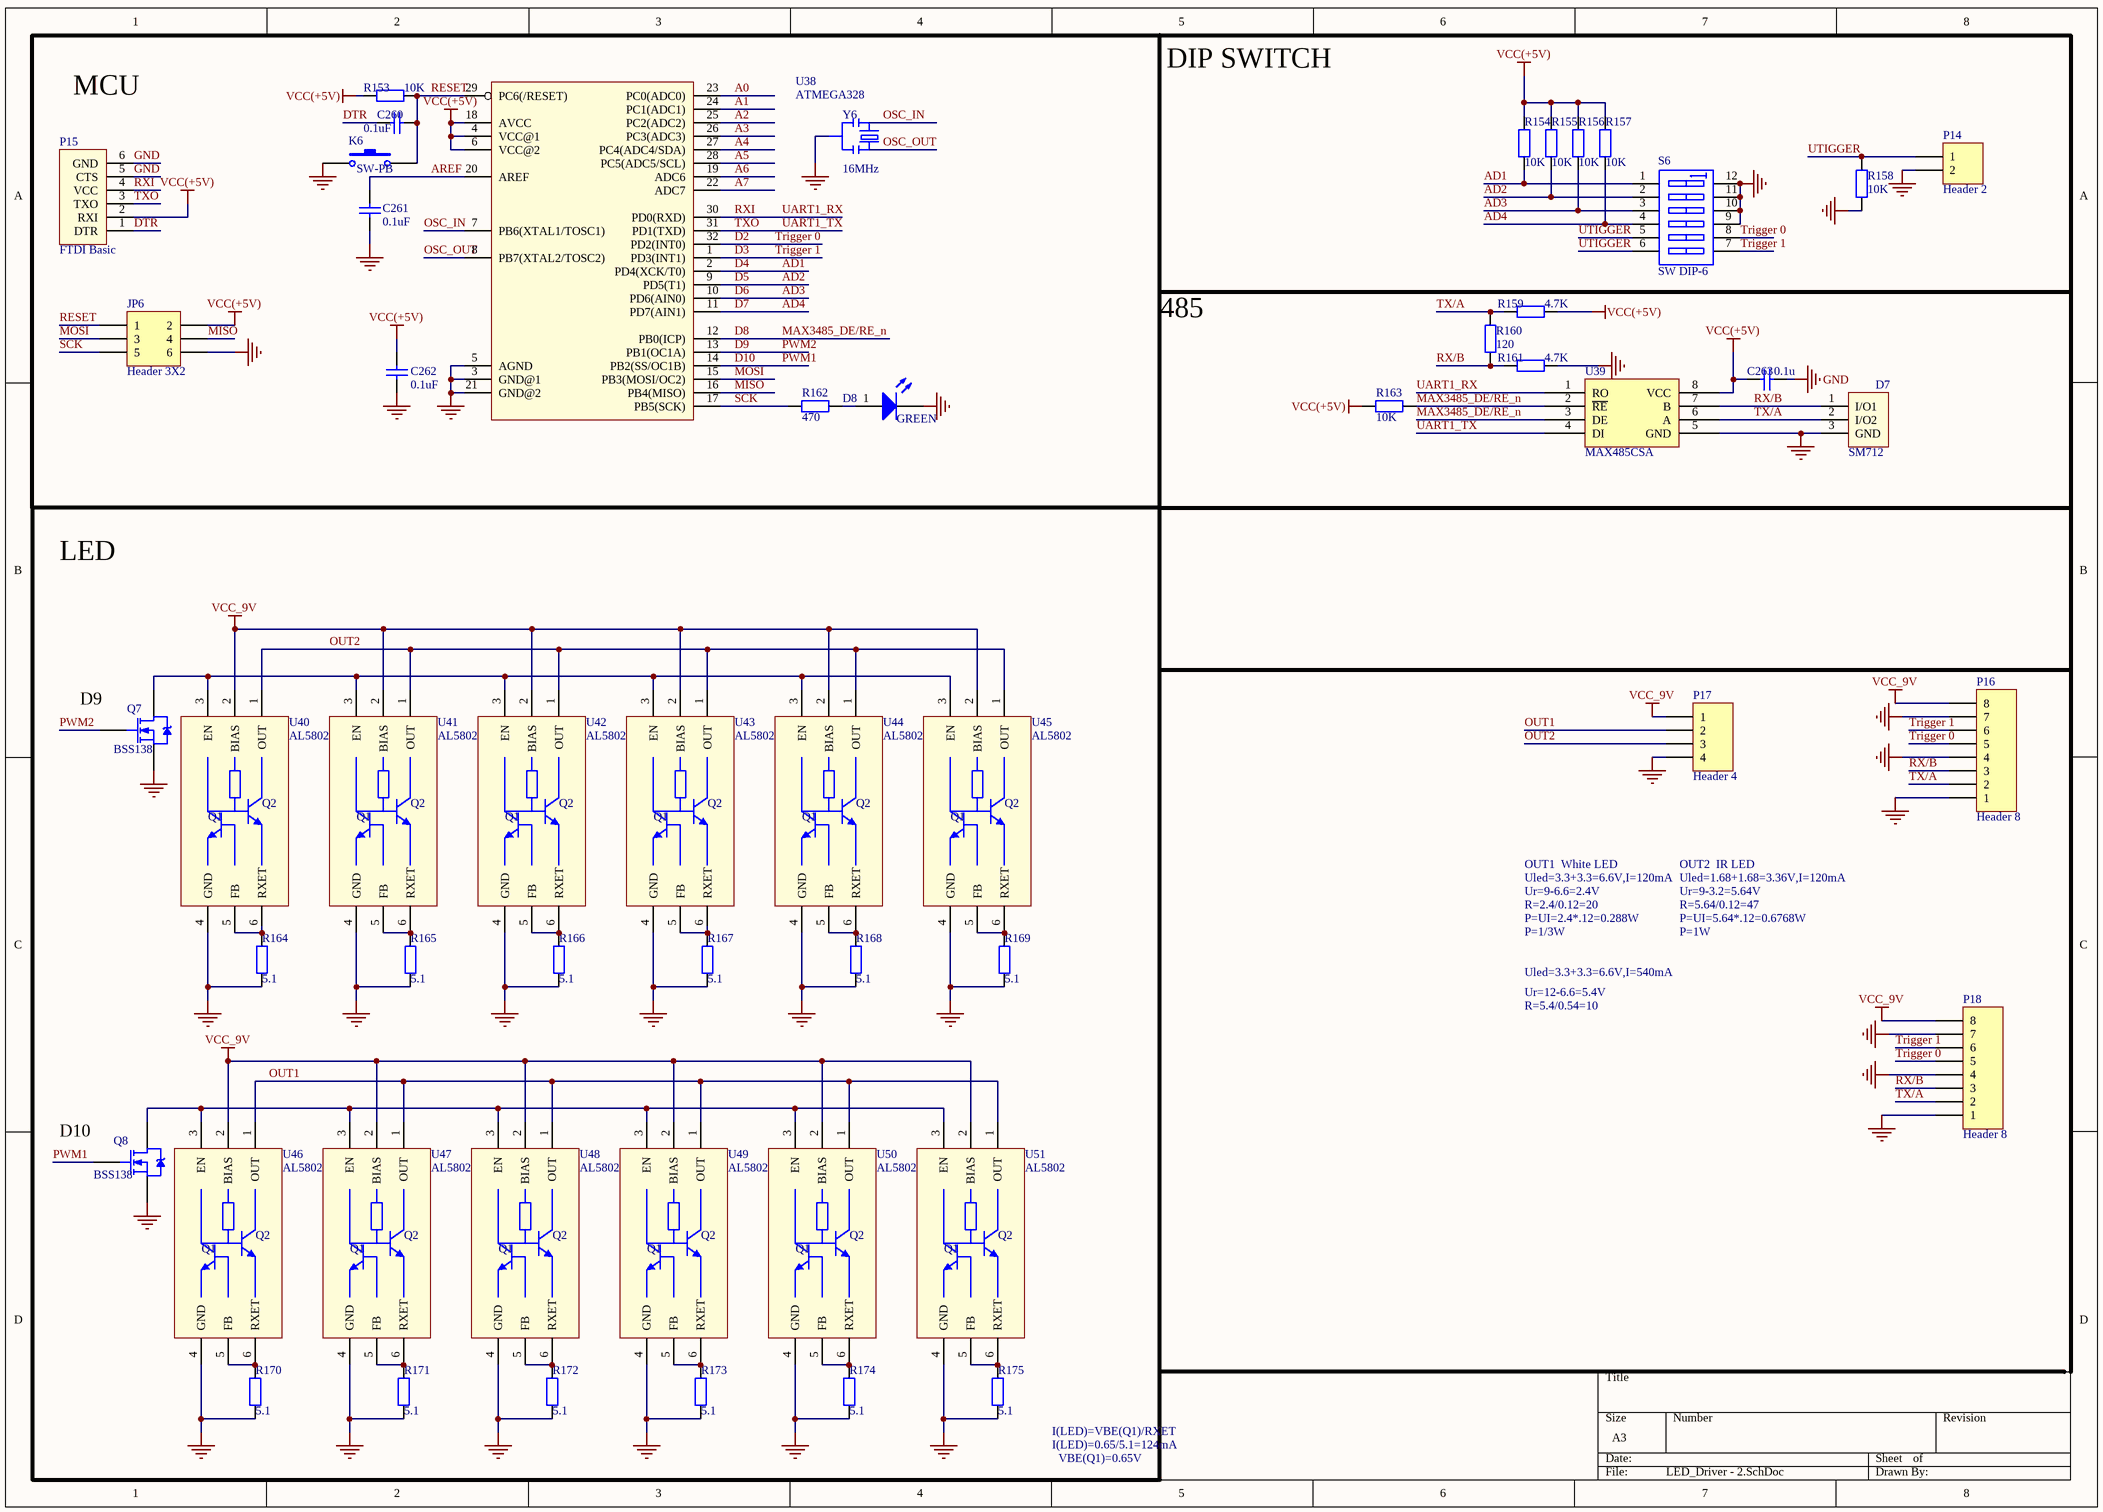
[diagram p3: LED_Driver - 2.SchDoc]

### Parts
C260  0.1uF  [C0603]
C261  0.1uF  [C0603]
C262  0.1uF  [C0603]
C263  0.1u  [C0603]
D7  SM712  [SOT23-3]
D8  GREEN  [LED0805]
JP6  Header 3X2  [MHDR1X6]
K6  SW-PB  [157SW]
P14  Header 2  [HDR1X2]
P15  FTDI Basic  [MHDR1X6]
P16  Header 8  [SH_1.25MM*8]
P17  Header 4  [SMT_1.25MM*4]
P18  Header 8  [SH_1.25MM*8]
Q7  BSS138  [SOT-23 (Standard)]
Q8  BSS138  [SOT-23 (Standard)]
R153  10K  [R0603]
R154  10K  [R0603]
R155  10K  [R0603]
R156  10K  [R0603]
R157  10K  [R0603]
R158  10K  [R0603]
R159  4.7K  [R0603]
R160  120  [R0603]
R161  4.7K  [R0603]
R162  470  [R0603]
R163  10K  [R0603]
R164  5.1  [R0603]
R165  5.1  [R0603]
R166  5.1  [R0603]
R167  5.1  [R0603]
R168  5.1  [R0603]
R169  5.1  [R0603]
R170  5.1  [R0603]
R171  5.1  [R0603]
R172  5.1  [R0603]
R173  5.1  [R0603]
R174  5.1  [R0603]
R175  5.1  [R0603]
S6  SW DIP-6  [DIP_SW_6WAY_SMD]
U38  ATMEGA328  [TQFP32-08]
U39  MAX485CSA  [SOIC-8]
U40  AL5802  [SOT26]
U41  AL5802  [SOT26]
U42  AL5802  [SOT26]
U43  AL5802  [SOT26]
U44  AL5802  [SOT26]
U45  AL5802  [SOT26]
U46  AL5802  [SOT26]
U47  AL5802  [SOT26]
U48  AL5802  [SOT26]
U49  AL5802  [SOT26]
U50  AL5802  [SOT26]
U51  AL5802  [SOT26]
Y6  16MHz  [RESONATOR-SMD]

### Blocks framed on the sheet
LED: Q7 Q8 R164-R175 U40-U51

### Nets
GND: C261.1 C262.2 C263.1 D7.3(GND) D8.2(K) JP6.6 K6.1 P14.2 P15.5(CTS) P15.6(GND) P16.1 P16.4 P16.7 P17.4 P18.1 P18.4 P18.7 Q7.S Q8.S R158.1 R161.1 R164.2 R165.2 R166.2 R167.2 R168.2 R169.2 R170.2 R171.2 R172.2 R173.2 R174.2 R175.2 S6.9(B4) S6.10(B3) S6.11(B2) S6.12(B1) U38.3(GND@1) U38.5(AGND) U38.21(GND@2) U39.5(GND) U40.4(GND) U41.4(GND) U42.4(GND) U43.4(GND) U44.4(GND) U45.4(GND) U46.4(GND) U47.4(GND) U48.4(GND) U49.4(GND) U50.4(GND) U51.4(GND) Y6.2
VCC(+5V): C262.1 C263.2 JP6.2 P15.2(RXI) R153.1 R154.1 R155.1 R156.1 R157.1 R159.1 R163.2 U38.4(VCC@1) U38.6(VCC@2) U38.18(AVCC) U39.8(VCC)
VCC_9V: P16.8 P17.1 P18.8 U40.2(BIAS) U41.2(BIAS) U42.2(BIAS) U43.2(BIAS) U44.2(BIAS) U45.2(BIAS) U46.2(BIAS) U47.2(BIAS) U48.2(BIAS) U49.2(BIAS) U50.2(BIAS) U51.2(BIAS)
A0: U38.23(PC0(ADC0))
A1: U38.24(PC1(ADC1))
A2: U38.25(PC2(ADC2))
A3: U38.26(PC3(ADC3))
A4: U38.27(PC4(ADC4/SDA))
A5: U38.28(PC5(ADC5/SCL))
A6: U38.19(ADC6)
A7: U38.22(ADC7)
AD1: R154.2 S6.1(A1) U38.2(PD4(XCK/T0))  [also labelled D4]
AD2: R155.2 S6.2(A2) U38.9(PD5(T1))  [also labelled D5]
AD3: R156.2 S6.3(A3) U38.10(PD6(AIN0))  [also labelled D6]
AD4: R157.2 S6.4(A4) U38.11(PD7(AIN1))  [also labelled D7]
AREF: C261.2 U38.20(AREF)
D2: P16.5 P18.5 S6.8(B5) U38.32(PD2(INT0))  [also labelled Trigger 0]
D3: P16.6 P18.6 S6.7(B6) U38.1(PD3(INT1))  [also labelled Trigger 1]
D8: R163.1 U38.12(PB0(ICP)) U39.2(~{RE}) U39.3(DE)  [also labelled MAX3485_DE/RE_n]
D9: Q7.G U38.13(PB1(OC1A))  [also labelled PWM2]
D10: Q8.G U38.14(PB2(SS/OC1B))  [also labelled PWM1]
DTR: C260.1 P15.1(DTR)
MISO: JP6.4 U38.16(PB4(MISO))
MOSI: JP6.3 U38.15(PB3(MOSI/OC2))
OSC_IN: U38.7(PB6(XTAL1/TOSC1)) Y6.3
OSC_OUT: U38.8(PB7(XTAL2/TOSC2)) Y6.1
OUT1: P17.2 U46.1(OUT) U47.1(OUT) U48.1(OUT) U49.1(OUT) U50.1(OUT) U51.1(OUT)
OUT2: P17.3 U40.1(OUT) U41.1(OUT) U42.1(OUT) U43.1(OUT) U44.1(OUT) U45.1(OUT)
RESET: C260.2 JP6.1 K6.2 R153.2 U38.29(PC6(/RESET))
RX/B: D7.1(I/O1) P16.3 P18.3 R160.2 R161.2 U39.7(B)
RXI: P15.4(VCC) U38.30(PD0(RXD)) U39.1(RO)  [also labelled UART1_RX]
SCK: JP6.5 R162.1 U38.17(PB5(SCK))
TX/A: D7.2(I/O2) P16.2 P18.2 R159.2 R160.1 U39.6(A)
TXO: P15.3(TXO) U38.31(PD1(TXD)) U39.4(DI)  [also labelled UART1_TX]
UTIGGER: P14.1 R158.2 S6.5(A5) S6.6(A6)
NetD8_1: D8.1(A) R162.2
NetQ7_D: Q7.D U40.3(EN) U41.3(EN) U42.3(EN) U43.3(EN) U44.3(EN) U45.3(EN)
NetQ8_D: Q8.D U46.3(EN) U47.3(EN) U48.3(EN) U49.3(EN) U50.3(EN) U51.3(EN)
NetR164_1: R164.1 U40.5(FB) U40.6(RXET)
NetR165_1: R165.1 U41.5(FB) U41.6(RXET)
NetR166_1: R166.1 U42.5(FB) U42.6(RXET)
NetR167_1: R167.1 U43.5(FB) U43.6(RXET)
NetR168_1: R168.1 U44.5(FB) U44.6(RXET)
NetR169_1: R169.1 U45.5(FB) U45.6(RXET)
NetR170_1: R170.1 U46.5(FB) U46.6(RXET)
NetR171_1: R171.1 U47.5(FB) U47.6(RXET)
NetR172_1: R172.1 U48.5(FB) U48.6(RXET)
NetR173_1: R173.1 U49.5(FB) U49.6(RXET)
NetR174_1: R174.1 U50.5(FB) U50.6(RXET)
NetR175_1: R175.1 U51.5(FB) U51.6(RXET)

### Notes on the sheet
- MCU
- DIP SWITCH
- 485
- (near Q7) D9
- Uled=3.3+3.3=6.6V,I=120mA
- OUT1  White LED
- R=2.4/0.12=20
- P=UI=2.4*.12=0.288W
- Ur=9-6.6=2.4V
- Uled=1.68+1.68=3.36V,I=120mA
- OUT2  IR LED
- R=5.64/0.12=47
- P=UI=5.64*.12=0.6768W
- Ur=9-3.2=5.64V
- P=1/3W
- Uled=3.3+3.3=6.6V,I=540mA
- Ur=12-6.6=5.4V
- P=1W
- R=5.4/0.54=10
- (near Q8) D10
- I(LED)=VBE(Q1)/RXET
- I(LED)=0.65/5.1=124mA
- VBE(Q1)=0.65V
- (in symbol AL5802) Q2; Q1

### Library data of the parts
C260-C262 = CAP SMT C100nF25V10%X7R: Capacitor; Voltage: 25V; iPartNumber: C100nF25V10%X7R; Value: 0.1uF
C263 = Cap: Capacitor; Value: 100pF; Published: 8-Jun-2000; LatestRevisionDate: 17-Jul-2002; LatestRevisionNote: Re-released for DXP Platform.; PackageReference: RAD-0.3; Publisher: Altium Limited
D8 = LED0: Typical INFRARED GaAs LED; Published: 8-Jun-2000; LatestRevisionDate: 08-Jul-2005; LatestRevisionNote: Mech Layer 1 removed.; PackageReference: LED-0; Publisher: Altium Limited
JP6 = Header 3X2: Header, 3-Pin, Dual row; LatestRevisionDate: 17-Jul-2002; LatestRevisionNote: Re-released for DXP Platform.; Publisher: Altium Limited
K6 = SW-PB: Switch; Published: 24-Mar-1999; LatestRevisionDate: 17-Jul-2002; LatestRevisionNote: Re-released for DXP Platform.; PackageReference: SPST-2; Publisher: Altium Limited; PackageDescription: Switch; 2 Leads
P14 = Header 2: Header, 2-Pin; LatestRevisionDate: 17-Jul-2002; LatestRevisionNote: Re-released for DXP Platform.; Publisher: Altium Limited
P15 = ARDUINO_SERIAL_PROGRAMPTH
P16 P18 = Header 8: Header, 8-Pin; LatestRevisionDate: 17-Jul-2002; LatestRevisionNote: Re-released for DXP Platform.; Publisher: Altium Limited
P17 = Header 4: Header, 4-Pin; LatestRevisionDate: 17-Jul-2002; LatestRevisionNote: Re-released for DXP Platform.; Publisher: Altium Limited
Q7 Q8 = NMOS: Manufacturer: Fairchild Semiconductor; Manufacturer Part Number: BSS123; FET Type: MOSFET N-Channel, Metal Oxide; FET Feature: Logic Level Gate; Drain to Source Voltage (Vdss): 100V; Current - Continuous Drain (Id) @ 25°C: 170mA (Ta); Rds On (Max) @ Id, Vgs: 6 Ohm @ 170mA, 10V; Vgs(th) (Max) @ Id: 2V @ 1mA; Gate Charge (Qg) @ Vgs: 2.5nC @ 10V; Input Capacitance (Ciss) @ Vds: 73pF @ 25V; Power - Max: 360mW; Supplier 1: Digi-Key; Supplier Part Number 1: BSS123NCT-ND; RoHS: RoHS Compliant; Category: Discrete Semiconductor Products; Stock 1: 163946; Pricing 1: 1=0.24, 10=0.216, 25=0.1556, 100=0.1211, 250=0.07612, 500=0.06484, 1000=0.04418 (USD); Packaging: Cut Tape (CT); Mounting Type: Surface Mount; Package / Case: TO-236-3, SC-59, SOT-23-3; Supplier Device Package: SOT-23; ComponentLink1URL: http://www.fairchildsemi.com/datasheets/BS/BSS123.pdf; ComponentLink1Description: http://www.fairchildsemi.com/datasheets/BS/BSS123.pdf
R153-R157 R159-R175 = Res2: Resistor
R158 = Res2: Resistor; Value: 1k; Published: 8-Jun-2000; LatestRevisionDate: 17-Jul-2002; LatestRevisionNote: Re-released for DXP Platform.; PackageReference: AXIAL-0.4; Publisher: Altium Limited
S6 = SW DIP-6: DIP Switch, 6 Position, SPST; Published: 24-Mar-1999; LatestRevisionDate: 17-Jul-2002; LatestRevisionNote: Re-released for DXP Platform.; PackageReference: DIP-12/SW; Publisher: Altium Limited
U38 = ATMEGA168
U39 = MAX3485CSA
Y6 = RESONATORSMD

## Sheet LED_Driver - 3.SchDoc
size A3
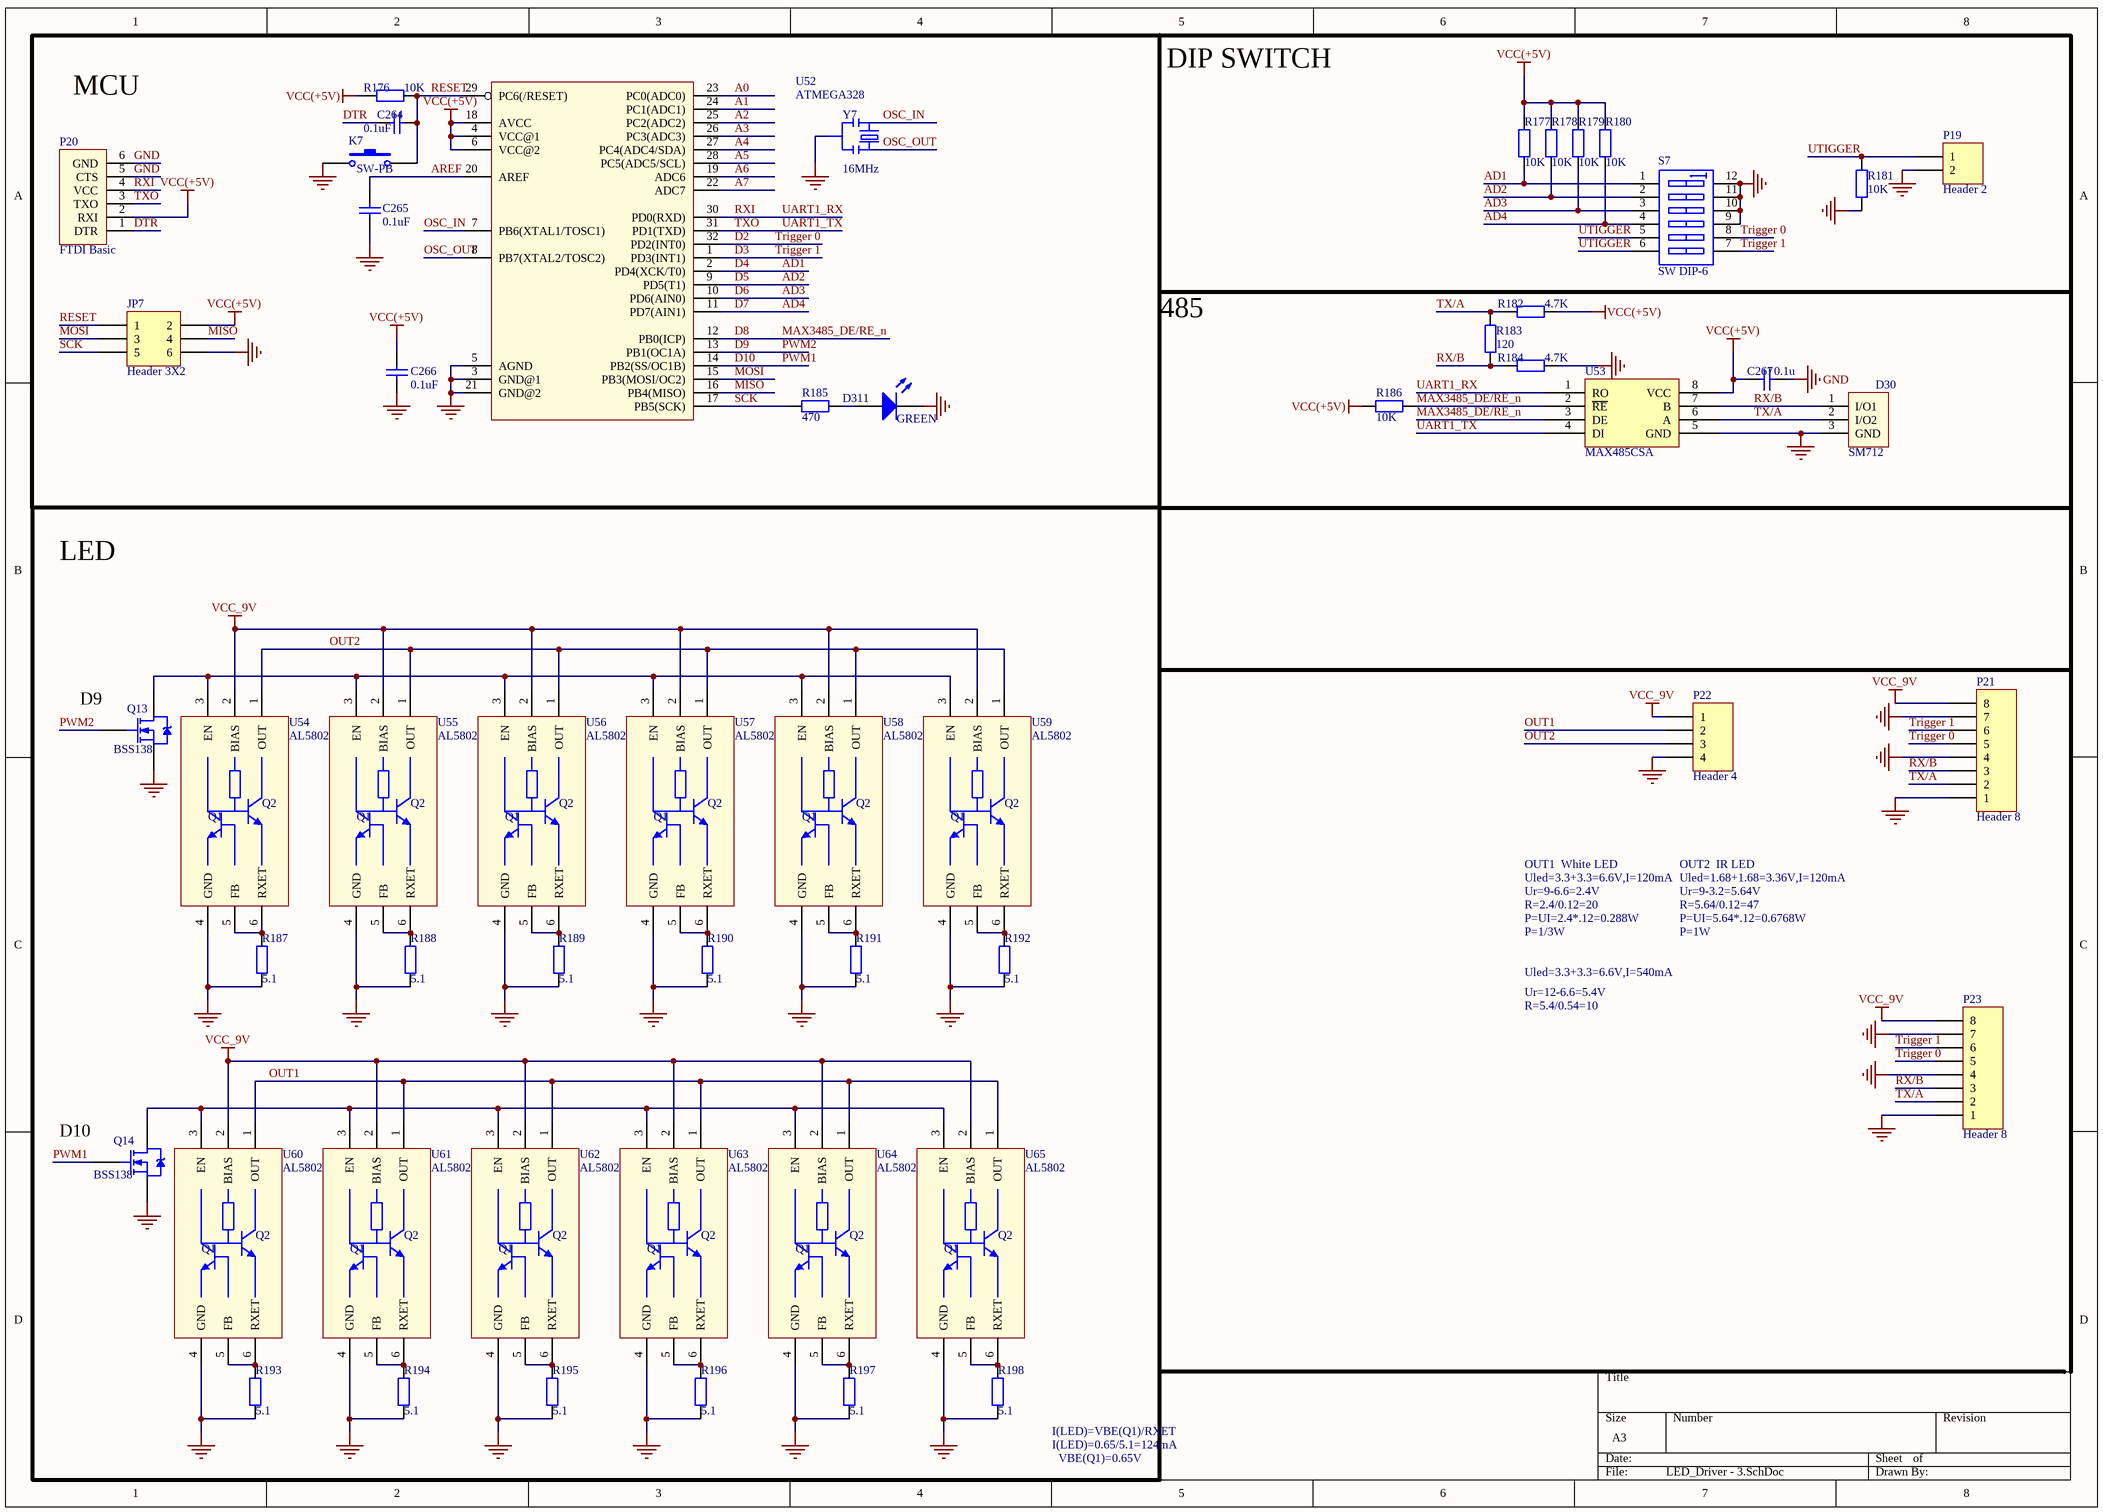
[diagram p4: LED_Driver - 3.SchDoc]

### Parts
C264  0.1uF  [C0603]
C265  0.1uF  [C0603]
C266  0.1uF  [C0603]
C267  0.1u  [C0603]
D30  SM712  [SOT23-3]
D31  GREEN  [LED0805]
JP7  Header 3X2  [MHDR1X6]
K7  SW-PB  [157SW]
P19  Header 2  [HDR1X2]
P20  FTDI Basic  [MHDR1X6]
P21  Header 8  [SH_1.25MM*8]
P22  Header 4  [SMT_1.25MM*4]
P23  Header 8  [SH_1.25MM*8]
Q13  BSS138  [SOT-23 (Standard)]
Q14  BSS138  [SOT-23 (Standard)]
R176  10K  [R0603]
R177  10K  [R0603]
R178  10K  [R0603]
R179  10K  [R0603]
R180  10K  [R0603]
R181  10K  [R0603]
R182  4.7K  [R0603]
R183  120  [R0603]
R184  4.7K  [R0603]
R185  470  [R0603]
R186  10K  [R0603]
R187  5.1  [R0603]
R188  5.1  [R0603]
R189  5.1  [R0603]
R190  5.1  [R0603]
R191  5.1  [R0603]
R192  5.1  [R0603]
R193  5.1  [R0603]
R194  5.1  [R0603]
R195  5.1  [R0603]
R196  5.1  [R0603]
R197  5.1  [R0603]
R198  5.1  [R0603]
S7  SW DIP-6  [DIP_SW_6WAY_SMD]
U52  ATMEGA328  [TQFP32-08]
U53  MAX485CSA  [SOIC-8]
U54  AL5802  [SOT26]
U55  AL5802  [SOT26]
U56  AL5802  [SOT26]
U57  AL5802  [SOT26]
U58  AL5802  [SOT26]
U59  AL5802  [SOT26]
U60  AL5802  [SOT26]
U61  AL5802  [SOT26]
U62  AL5802  [SOT26]
U63  AL5802  [SOT26]
U64  AL5802  [SOT26]
U65  AL5802  [SOT26]
Y7  16MHz  [RESONATOR-SMD]

### Blocks framed on the sheet
LED: Q13 Q14 R187-R198 U54-U65

### Nets
GND: C265.1 C266.2 C267.1 D30.3(GND) D31.2(K) JP7.6 K7.1 P19.2 P20.5(CTS) P20.6(GND) P21.1 P21.4 P21.7 P22.4 P23.1 P23.4 P23.7 Q13.S Q14.S R181.1 R184.1 R187.2 R188.2 R189.2 R190.2 R191.2 R192.2 R193.2 R194.2 R195.2 R196.2 R197.2 R198.2 S7.9(B4) S7.10(B3) S7.11(B2) S7.12(B1) U52.3(GND@1) U52.5(AGND) U52.21(GND@2) U53.5(GND) U54.4(GND) U55.4(GND) U56.4(GND) U57.4(GND) U58.4(GND) U59.4(GND) U60.4(GND) U61.4(GND) U62.4(GND) U63.4(GND) U64.4(GND) U65.4(GND) Y7.2
VCC(+5V): C266.1 C267.2 JP7.2 P20.2(RXI) R176.1 R177.1 R178.1 R179.1 R180.1 R182.1 R186.2 U52.4(VCC@1) U52.6(VCC@2) U52.18(AVCC) U53.8(VCC)
VCC_9V: P21.8 P22.1 P23.8 U54.2(BIAS) U55.2(BIAS) U56.2(BIAS) U57.2(BIAS) U58.2(BIAS) U59.2(BIAS) U60.2(BIAS) U61.2(BIAS) U62.2(BIAS) U63.2(BIAS) U64.2(BIAS) U65.2(BIAS)
A0: U52.23(PC0(ADC0))
A1: U52.24(PC1(ADC1))
A2: U52.25(PC2(ADC2))
A3: U52.26(PC3(ADC3))
A4: U52.27(PC4(ADC4/SDA))
A5: U52.28(PC5(ADC5/SCL))
A6: U52.19(ADC6)
A7: U52.22(ADC7)
AD1: R177.2 S7.1(A1) U52.2(PD4(XCK/T0))  [also labelled D4]
AD2: R178.2 S7.2(A2) U52.9(PD5(T1))  [also labelled D5]
AD3: R179.2 S7.3(A3) U52.10(PD6(AIN0))  [also labelled D6]
AD4: R180.2 S7.4(A4) U52.11(PD7(AIN1))  [also labelled D7]
AREF: C265.2 U52.20(AREF)
D2: P21.5 P23.5 S7.8(B5) U52.32(PD2(INT0))  [also labelled Trigger 0]
D3: P21.6 P23.6 S7.7(B6) U52.1(PD3(INT1))  [also labelled Trigger 1]
D8: R186.1 U52.12(PB0(ICP)) U53.2(~{RE}) U53.3(DE)  [also labelled MAX3485_DE/RE_n]
D9: Q13.G U52.13(PB1(OC1A))  [also labelled PWM2]
D10: Q14.G U52.14(PB2(SS/OC1B))  [also labelled PWM1]
DTR: C264.1 P20.1(DTR)
MISO: JP7.4 U52.16(PB4(MISO))
MOSI: JP7.3 U52.15(PB3(MOSI/OC2))
OSC_IN: U52.7(PB6(XTAL1/TOSC1)) Y7.3
OSC_OUT: U52.8(PB7(XTAL2/TOSC2)) Y7.1
OUT1: P22.2 U60.1(OUT) U61.1(OUT) U62.1(OUT) U63.1(OUT) U64.1(OUT) U65.1(OUT)
OUT2: P22.3 U54.1(OUT) U55.1(OUT) U56.1(OUT) U57.1(OUT) U58.1(OUT) U59.1(OUT)
RESET: C264.2 JP7.1 K7.2 R176.2 U52.29(PC6(/RESET))
RX/B: D30.1(I/O1) P21.3 P23.3 R183.2 R184.2 U53.7(B)
RXI: P20.4(VCC) U52.30(PD0(RXD)) U53.1(RO)  [also labelled UART1_RX]
SCK: JP7.5 R185.1 U52.17(PB5(SCK))
TX/A: D30.2(I/O2) P21.2 P23.2 R182.2 R183.1 U53.6(A)
TXO: P20.3(TXO) U52.31(PD1(TXD)) U53.4(DI)  [also labelled UART1_TX]
UTIGGER: P19.1 R181.2 S7.5(A5) S7.6(A6)
NetD31_1: D31.1(A) R185.2
NetQ13_D: Q13.D U54.3(EN) U55.3(EN) U56.3(EN) U57.3(EN) U58.3(EN) U59.3(EN)
NetQ14_D: Q14.D U60.3(EN) U61.3(EN) U62.3(EN) U63.3(EN) U64.3(EN) U65.3(EN)
NetR187_1: R187.1 U54.5(FB) U54.6(RXET)
NetR188_1: R188.1 U55.5(FB) U55.6(RXET)
NetR189_1: R189.1 U56.5(FB) U56.6(RXET)
NetR190_1: R190.1 U57.5(FB) U57.6(RXET)
NetR191_1: R191.1 U58.5(FB) U58.6(RXET)
NetR192_1: R192.1 U59.5(FB) U59.6(RXET)
NetR193_1: R193.1 U60.5(FB) U60.6(RXET)
NetR194_1: R194.1 U61.5(FB) U61.6(RXET)
NetR195_1: R195.1 U62.5(FB) U62.6(RXET)
NetR196_1: R196.1 U63.5(FB) U63.6(RXET)
NetR197_1: R197.1 U64.5(FB) U64.6(RXET)
NetR198_1: R198.1 U65.5(FB) U65.6(RXET)

### Notes on the sheet
- MCU
- DIP SWITCH
- 485
- (near Q13) D9
- Uled=3.3+3.3=6.6V,I=120mA
- OUT1  White LED
- R=2.4/0.12=20
- P=UI=2.4*.12=0.288W
- Ur=9-6.6=2.4V
- Uled=1.68+1.68=3.36V,I=120mA
- OUT2  IR LED
- R=5.64/0.12=47
- P=UI=5.64*.12=0.6768W
- Ur=9-3.2=5.64V
- P=1/3W
- Uled=3.3+3.3=6.6V,I=540mA
- Ur=12-6.6=5.4V
- P=1W
- R=5.4/0.54=10
- (near Q14) D10
- I(LED)=VBE(Q1)/RXET
- I(LED)=0.65/5.1=124mA
- VBE(Q1)=0.65V
- (in symbol AL5802) Q2; Q1

### Library data of the parts
C264-C266 = CAP SMT C100nF25V10%X7R: Capacitor; Voltage: 25V; iPartNumber: C100nF25V10%X7R; Value: 0.1uF
C267 = Cap: Capacitor; Value: 100pF; Published: 8-Jun-2000; LatestRevisionDate: 17-Jul-2002; LatestRevisionNote: Re-released for DXP Platform.; PackageReference: RAD-0.3; Publisher: Altium Limited
D31 = LED0: Typical INFRARED GaAs LED; Published: 8-Jun-2000; LatestRevisionDate: 08-Jul-2005; LatestRevisionNote: Mech Layer 1 removed.; PackageReference: LED-0; Publisher: Altium Limited
JP7 = Header 3X2: Header, 3-Pin, Dual row; LatestRevisionDate: 17-Jul-2002; LatestRevisionNote: Re-released for DXP Platform.; Publisher: Altium Limited
K7 = SW-PB: Switch; Published: 24-Mar-1999; LatestRevisionDate: 17-Jul-2002; LatestRevisionNote: Re-released for DXP Platform.; PackageReference: SPST-2; Publisher: Altium Limited; PackageDescription: Switch; 2 Leads
P19 = Header 2: Header, 2-Pin; LatestRevisionDate: 17-Jul-2002; LatestRevisionNote: Re-released for DXP Platform.; Publisher: Altium Limited
P20 = ARDUINO_SERIAL_PROGRAMPTH
P21 P23 = Header 8: Header, 8-Pin; LatestRevisionDate: 17-Jul-2002; LatestRevisionNote: Re-released for DXP Platform.; Publisher: Altium Limited
P22 = Header 4: Header, 4-Pin; LatestRevisionDate: 17-Jul-2002; LatestRevisionNote: Re-released for DXP Platform.; Publisher: Altium Limited
Q13 Q14 = NMOS: as Q7 on sheet LED_Driver - 2; Supplier 1: Digi-Key; Supplier Part Number 1: BSS123NCT-ND; RoHS: RoHS Compliant; Category: Discrete Semiconductor Products; Stock 1: 163946; Pricing 1: 1=0.24, 10=0.216, 25=0.1556, 100=0.1211, 250=0.07612, 500=0.06484, 1000=0.04418 (USD); Packaging: Cut Tape (CT); Mounting Type: Surface Mount; Package / Case: TO-236-3, SC-59, SOT-23-3; Supplier Device Package: SOT-23; ComponentLink1URL: http://www.fairchildsemi.com/datasheets/BS/BSS123.pdf; ComponentLink1Description: http://www.fairchildsemi.com/datasheets/BS/BSS123.pdf
R176-R180 R182-R198 = Res2: Resistor
R181 = Res2: Resistor; Value: 1k; Published: 8-Jun-2000; LatestRevisionDate: 17-Jul-2002; LatestRevisionNote: Re-released for DXP Platform.; PackageReference: AXIAL-0.4; Publisher: Altium Limited
S7 = SW DIP-6: DIP Switch, 6 Position, SPST; Published: 24-Mar-1999; LatestRevisionDate: 17-Jul-2002; LatestRevisionNote: Re-released for DXP Platform.; PackageReference: DIP-12/SW; Publisher: Altium Limited
U52 = ATMEGA168
U53 = MAX3485CSA
Y7 = RESONATORSMD